# EAGLE design Potentiostat (EAGLE 9.6.2)

## Sheet 1 of 6: Connector & Power Monitor
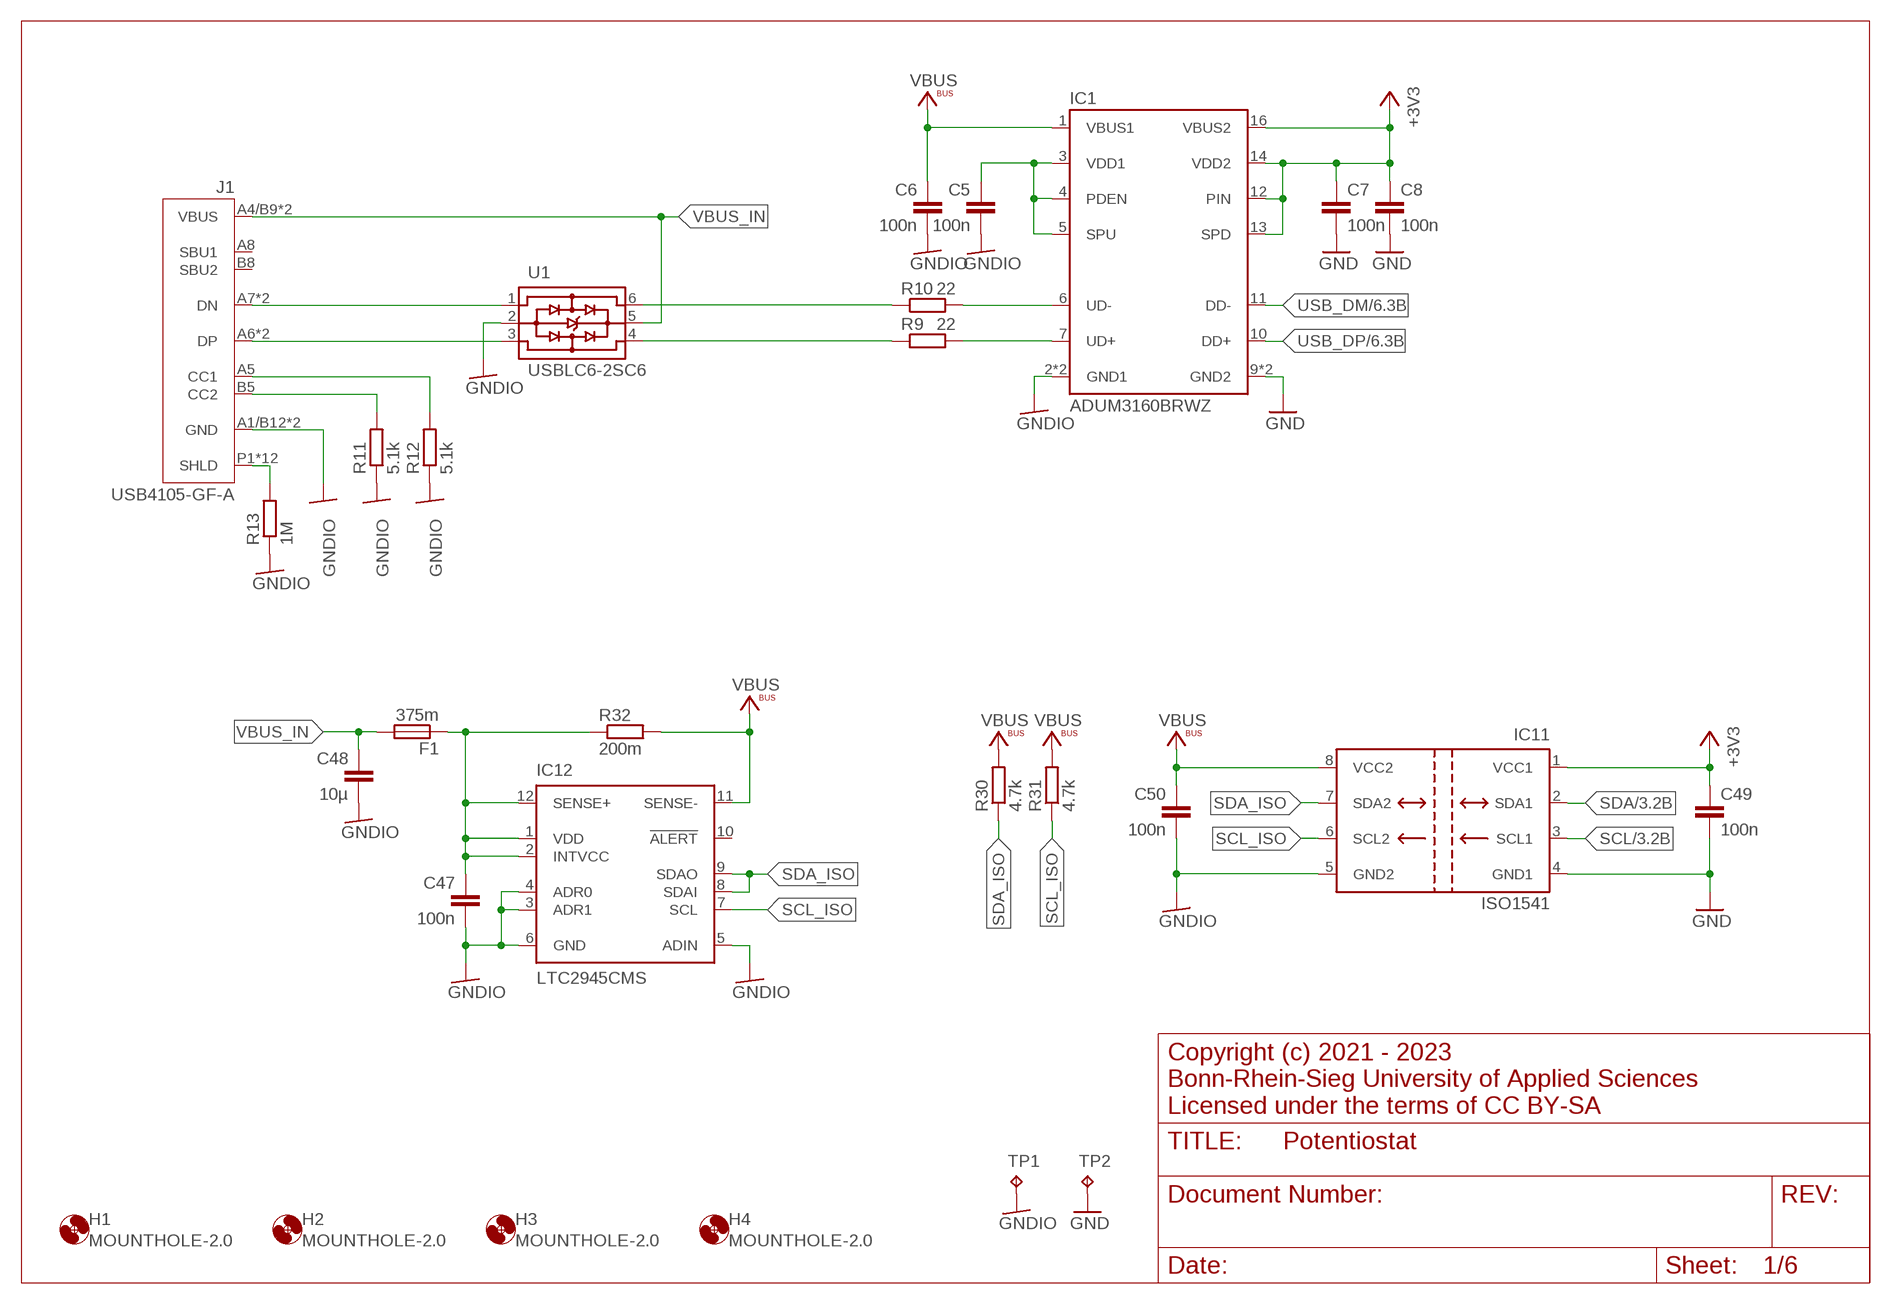
[diagram p0: schematic, sheet 1]

### Parts
C5  100n  C-EUC0603  [C0603]
C6  100n  C-EUC0603  [C0603]
C7  100n  C-EUC0603  [C0603]
C8  100n  C-EUC0603  [C0603]
C47  100n  C-EUC0603  [C0603]
C48  10µ  C-EUC0603  [C0603]
C49  100n  C-EUC0603  [C0603]
C50  100n  C-EUC0603  [C0603]
F1  375m  FUSE0603  [R0603]
H1  MOUNTHOLE-2.0  [2.0]
H2  MOUNTHOLE-2.0  [2.0]
H3  MOUNTHOLE-2.0  [2.0]
H4  MOUNTHOLE-2.0  [2.0]
IC1  ADUM3160BRWZ  [SO16W]
IC11  ISO1541  [SOIC8]
IC12  LTC2945CMS  [MSOP12]
J1  USB4105-GF-A  [USB4105-GF-A]
R9  22  R-EU_R0603  [R0603]
R10  22  R-EU_R0603  [R0603]
R11  5.1k  R-EU_R0603  [R0603]
R12  5.1k  R-EU_R0603  [R0603]
R13  1M  R-EU_R0603  [R0603]
R30  4.7k  R-EU_R0603  [R0603]
R31  4.7k  R-EU_R0603  [R0603]
R32  200m  R-EU_R0805  [R0805]
TP1  TP3.8X2.03  [3.8X2.03]
TP2  TP3.8X2.03  [3.8X2.03]
U1  USBLC6-2SC6  [SOT23-6L]

### Nets
+3V3: C7.1 C8.1 C49.1 IC1.12(PIN) IC1.13(SPD) IC1.14(VDD2) IC1.16(VBUS2) IC11.1(VCC1) ; also sheet 2,3,4,5,6
GND: C7.2 C8.2 C49.2 IC1.9(GND2) IC1.15(GND2) IC11.4(GND1) TP2.TP ; also sheet 2,3,4,5,6
GNDIO: C5.2 C6.2 C47.2 C48.2 C50.2 IC1.2(GND1) IC1.8(GND1) IC11.5(GND2) IC12.3(ADR1) IC12.4(ADR0) IC12.5(ADIN) IC12.6(GND) J1.A1/B12(GND) J1.B1/A12(GND) R11.1 R12.1 R13.1 TP1.TP U1.2 ; also sheet 2
N$6: C5.1 IC1.3(VDD1) IC1.4(PDEN) IC1.5(SPU)
N$7: R10.1 U1.6
N$8: R9.1 U1.4
N$9: IC1.7(UD+) R9.2
N$10: C47.1 F1.1 IC12.1(VDD) IC12.2(INTVCC) IC12.12(SENSE+) R32.1
N$11: J1.A7(DN) J1.B7(DN) U1.1
N$12: J1.A6(DP) J1.B6(DP) U1.3
N$13: J1.A5(CC1) R12.2
N$14: J1.B5(CC2) R11.2
N$16: J1.P1(SHLD) J1.P2(SHLD) J1.P3(SHLD) J1.P4(SHLD) J1.S1(SHLD) J1.S2(SHLD) J1.S3(SHLD) J1.S4(SHLD) J1.S5(SHLD) J1.S6(SHLD) J1.S7(SHLD) J1.S8(SHLD) R13.2
N$46: IC1.6(UD-) R10.2
SCL: IC11.3(SCL1) ; also sheet 3,6
SCL_ISO: IC11.6(SCL2) IC12.7(SCL) R31.1
SDA: IC11.2(SDA1) ; also sheet 3,6
SDA_ISO: IC11.7(SDA2) IC12.8(SDAI) IC12.9(SDAO) R30.1
USB_DM: IC1.11(DD-) ; also sheet 6
USB_DP: IC1.10(DD+) ; also sheet 6
VBUS: C6.1 C50.1 IC1.1(VBUS1) IC11.8(VCC2) IC12.11(SENSE-) R30.2 R31.2 R32.2 ; also sheet 2
VBUS_IN: C48.1 F1.2 J1.A4/B9(VBUS) J1.B4/A9(VBUS) U1.5
Unconnected: IC12.10(!ALERT!) J1.A8(SBU1) J1.B8(SBU2)

### Notes on the sheet
- Copyright (c) 2021 - 2023
  Bonn-Rhein-Sieg University of Applied Sciences
  Licensed under the terms of CC BY-SA

## Sheet 2 of 6: Power Supply
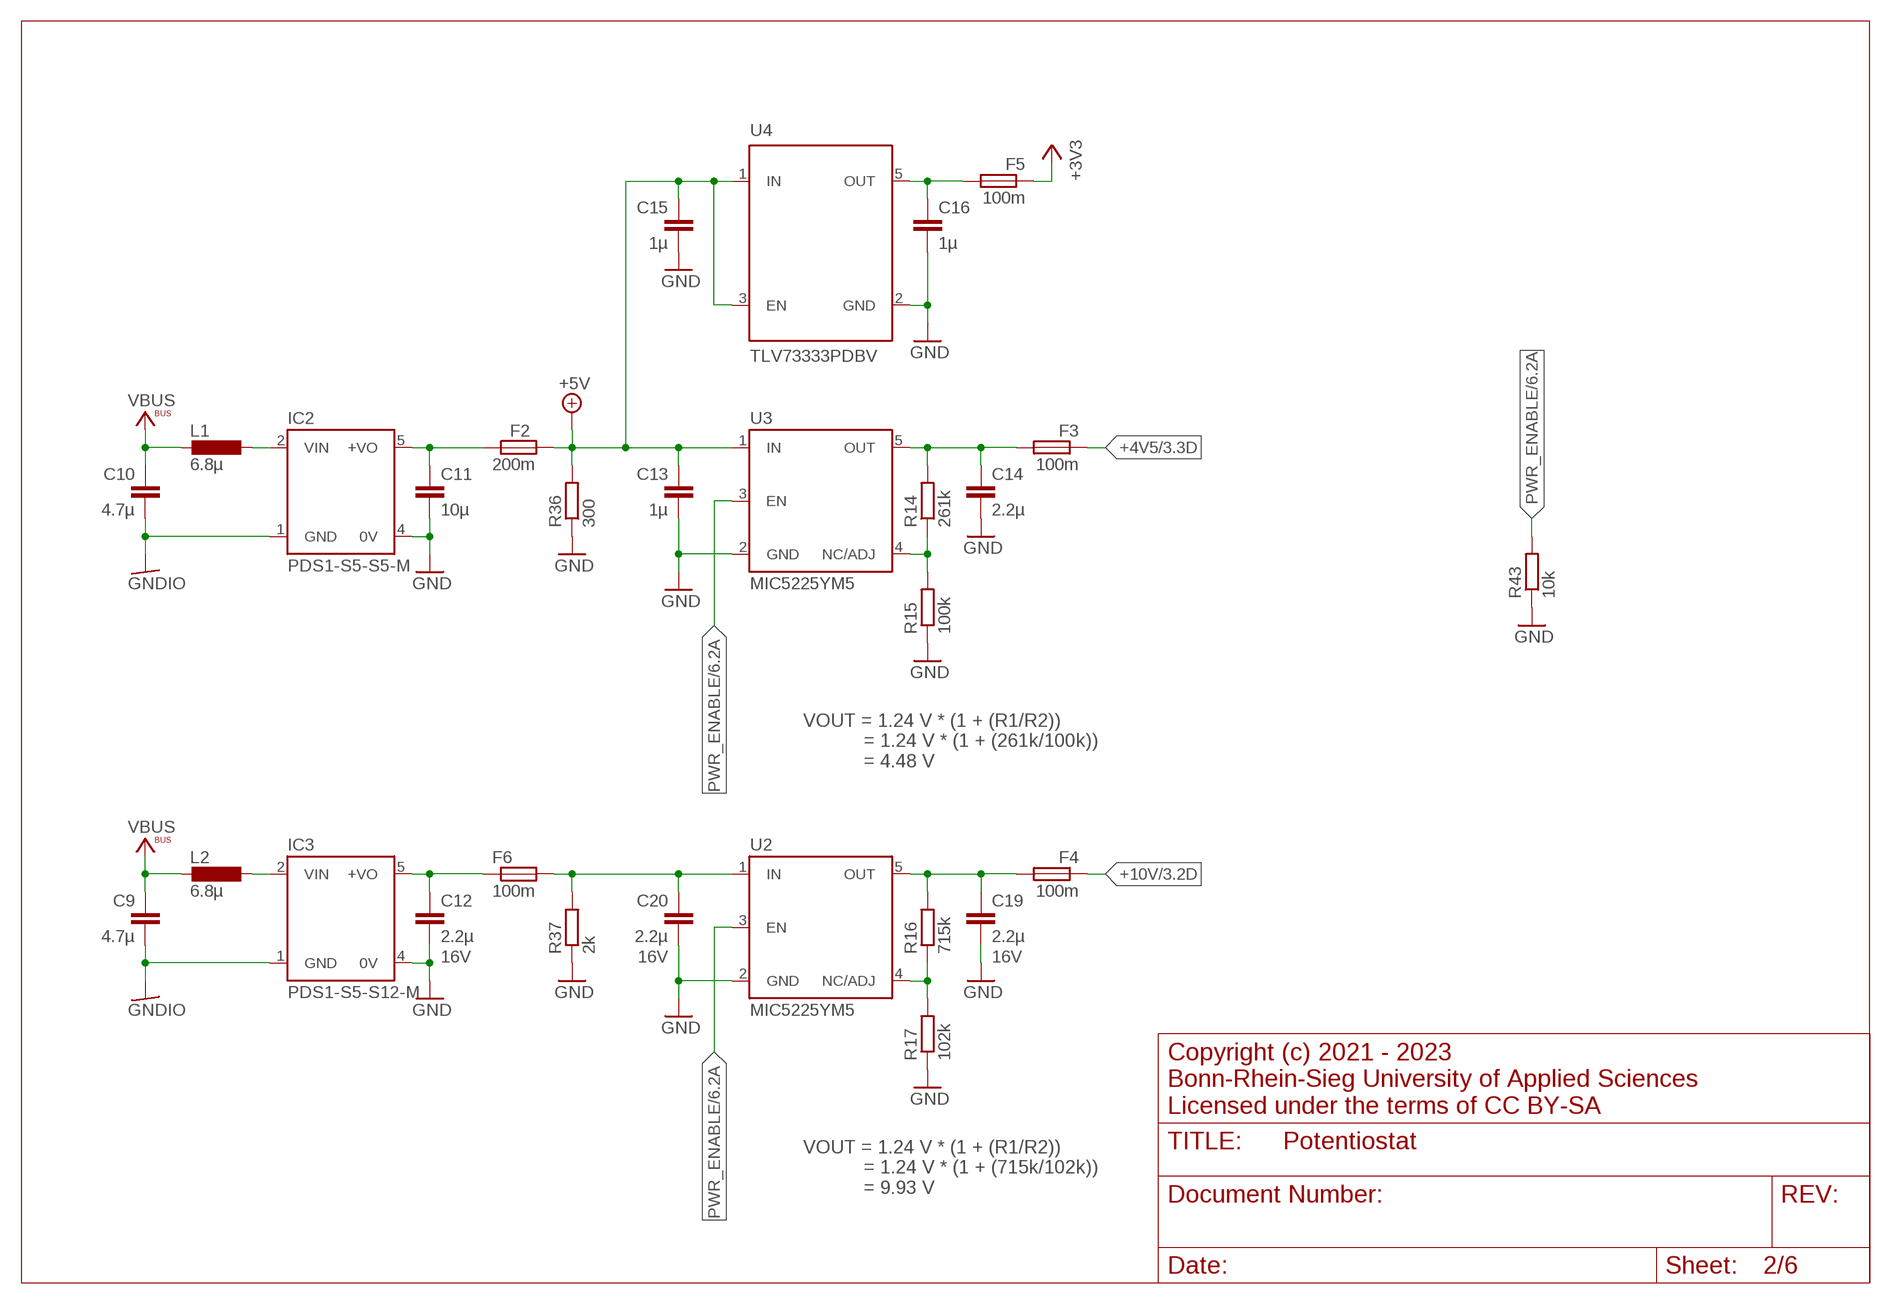
[diagram p1: schematic, sheet 2]

### Parts
C9  4.7µ  C-EUC0603  [C0603]
C10  4.7µ  C-EUC0603  [C0603]
C11  10µ  C-EUC0603  [C0603]
C12  2.2µ  C-EUC0603  [C0603]
C13  1µ  C-EUC0603  [C0603]
C14  2.2µ  C-EUC0603  [C0603]
C15  1µ  C-EUC0603  [C0603]
C16  1µ  C-EUC0603  [C0603]
C19  2.2µ  C-EUC0603  [C0603]
C20  2.2µ  C-EUC0603  [C0603]
F2  200m  FUSE0603  [R0603]
F3  100m  FUSE0603  [R0603]
F4  100m  FUSE0603  [R0603]
F5  100m  FUSE0603  [R0603]
F6  100m  FUSE0603  [R0603]
IC2  PDS1-S5-S5-M  [PDS1-M]
IC3  PDS1-S5-S12-M  [PDS1-M]
L1  6.8µ  L-EUL0603  [L0603]
L2  6.8µ  L-EUL0603  [L0603]
R14  261k  R-EU_R0603  [R0603]
R15  100k  R-EU_R0603  [R0603]
R16  715k  R-EU_R0603  [R0603]
R17  102k  R-EU_R0603  [R0603]
R36  300  R-EU_R0805  [R0805]
R37  2k  R-EU_R0805  [R0805]
R43  10k  R-EU_R0603  [R0603]
U2  MIC5225YM5  [SOT23-5L]
U3  MIC5225YM5  [SOT23-5L]
U4  TLV73333PDBV  [SOT-23]

### Nets
+3V3: F5.1 ; also sheet 1,3,4,5,6
+4V5: F3.1 ; also sheet 3,4,5
+5V: C13.1 C15.1 F2.2 R36.2 U3.1(IN) U4.1(IN) U4.3(EN)
+10V: F4.1 ; also sheet 3,4
GND: C11.2 C12.2 C13.2 C14.2 C15.2 C16.2 C19.2 C20.2 IC2.4(0V) IC3.4(0V) R15.1 R17.1 R36.1 R37.1 R43.1 U2.2(GND) U3.2(GND) U4.2(GND) ; also sheet 1,3,4,5,6
GNDIO: C9.2 C10.2 IC2.1(GND) IC3.1(GND) ; also sheet 1
N$15: R14.1 R15.2 U3.4(NC/ADJ)
N$19: C20.1 F6.2 R37.2 U2.1(IN)
N$20: R16.1 R17.2 U2.4(NC/ADJ)
N$35: C12.1 F6.1 IC3.5(+VO)
N$36: C16.1 F5.2 U4.5(OUT)
N$37: C14.1 F3.2 R14.2 U3.5(OUT)
N$38: C19.1 F4.2 R16.2 U2.5(OUT)
N$39: IC2.2(VIN) L1.1
N$41: IC3.2(VIN) L2.1
N$44: C11.1 F2.1 IC2.5(+VO)
PWR_ENABLE: R43.2 U2.3(EN) U3.3(EN) ; also sheet 6
VBUS: C9.1 C10.1 L1.2 L2.2 ; also sheet 1

### Notes on the sheet
- VOUT = 1.24 V * (1 + (R1/R2))
             = 1.24 V * (1 + (261k/100k))
             = 4.48 V
- Copyright (c) 2021 - 2023
  Bonn-Rhein-Sieg University of Applied Sciences
  Licensed under the terms of CC BY-SA
- VOUT = 1.24 V * (1 + (R1/R2))
             = 1.24 V * (1 + (715k/102k))
             = 9.93 V

## Sheet 3 of 6: Potentiostat Voltage
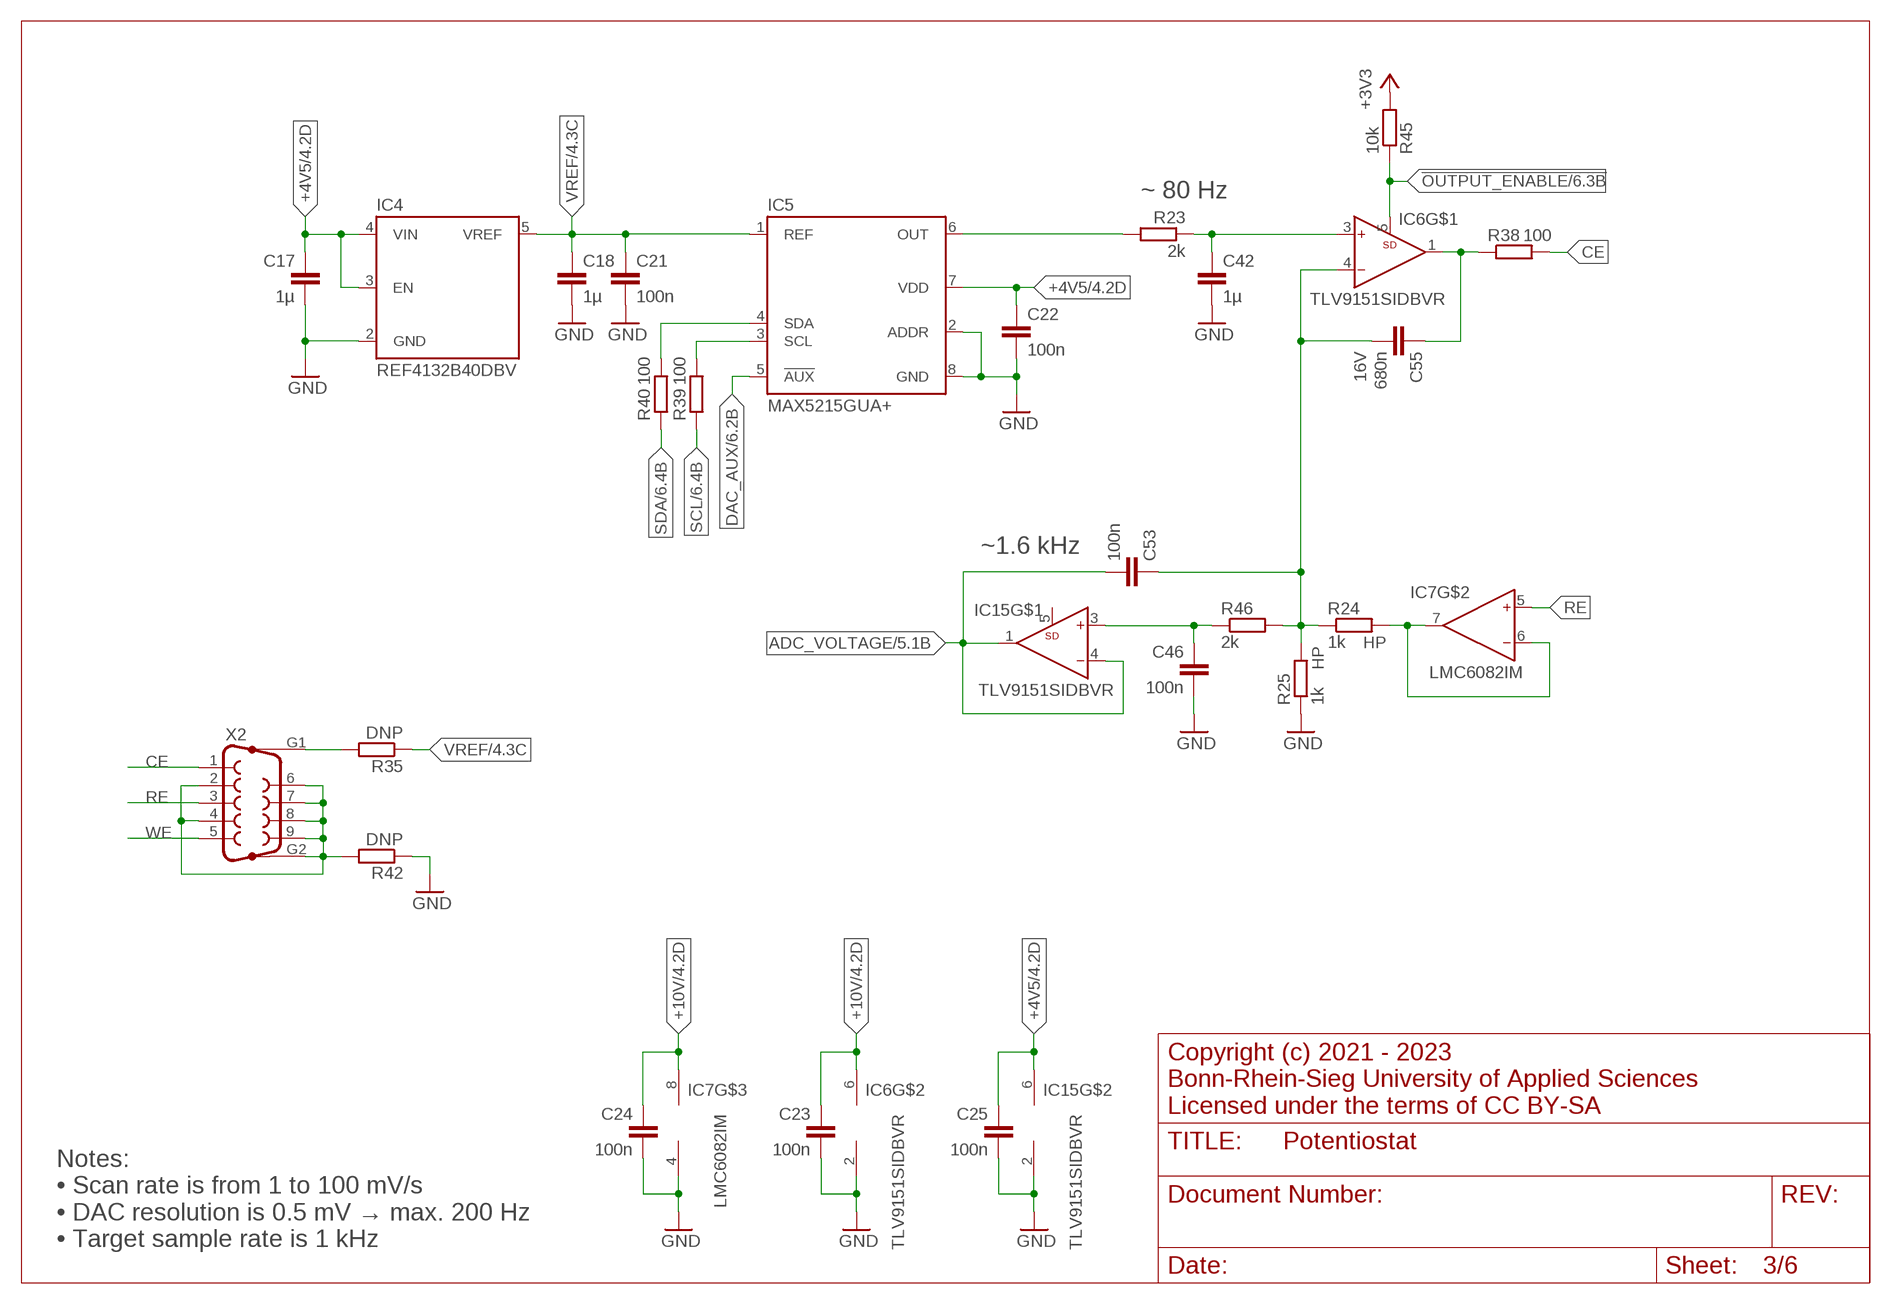
[diagram p2: schematic, sheet 3]

### Parts
C17  1µ  C-EUC0603  [C0603]
C18  1µ  C-EUC0603  [C0603]
C21  100n  C-EUC0603  [C0603]
C22  100n  C-EUC0603  [C0603]
C23  100n  C-EUC0603  [C0603]
C24  100n  C-EUC0603  [C0603]
C25  100n  C-EUC0603  [C0603]
C42  1µ  C-EUC0603  [C0603]
C46  100n  C-EUC0603  [C0603]
C53  100n  C-EUC0603  [C0603]
C55  680n  C-EUC0603  [C0603]
IC4  REF4132B40DBV  [SOT23-5]
IC5  MAX5215GUA+  [MSOP8]
IC6  TLV9151SIDBVR  [SOT23-6]
IC7  LMC6082IM  [SOIC8]
IC15  TLV9151SIDBVR  [SOT23-6]
R23  2k  R-EU_R0603  [R0603]
R24  1k  R-EU_R0603  [R0603]
R25  1k  R-EU_R0603  [R0603]
R35  DNP  R-EU_R0603  [R0603]
R38  100  R-EU_R0603  [R0603]
R39  100  R-EU_R0603  [R0603]
R40  100  R-EU_R0603  [R0603]
R42  DNP  R-EU_R0603  [R0603]
R45  10k  R-EU_R0603  [R0603]
R46  2k  R-EU_R0603  [R0603]
X2  A-DF_09  [A-DF_09]

### Nets
!OUTPUT_ENABLE: IC6.5(SD) R45.1 ; also sheet 6
+3V3: R45.2 ; also sheet 1,2,4,5,6
+4V5: C17.1 C22.1 C25.1 IC4.3(EN) IC4.4(VIN) IC5.7(VDD) IC15.6(V+) ; also sheet 2,4,5
+10V: C23.1 C24.1 IC6.6(V+) IC7.8(V+) ; also sheet 2,4
ADC_VOLTAGE: C53.2 IC15.1(OUT) IC15.4(IN-) ; also sheet 5
CE: R38.2 X2.1
DAC_AUX: IC5.5(!AUX) ; also sheet 6
GND: C17.2 C18.2 C21.2 C22.2 C23.2 C24.2 C25.2 C42.2 C46.2 IC4.2(GND) IC5.2(ADDR) IC5.8(GND) IC6.2(V-) IC7.4(V-) IC15.2(V-) R25.1 R42.1 ; also sheet 1,2,4,5,6
N$1: IC5.6(OUT) R23.2
N$2: IC7.6(IN-) IC7.7(OUT) R24.2
N$3: C53.1 C55.2 IC6.4(IN-) R24.1 R25.2 R46.2
N$27: C42.1 IC6.3(IN+) R23.1
N$33: C55.1 IC6.1(OUT) R38.1
N$34: IC5.3(SCL) R39.2
N$40: R42.2 X2.2 X2.4 X2.6 X2.7 X2.8 X2.9 X2.G2
N$42: R35.2 X2.G1
N$45: IC5.4(SDA) R40.2
N$47: C46.1 IC15.3(IN+) R46.1
RE: IC7.5(IN+) X2.3
SCL: R39.1 ; also sheet 1,6
SDA: R40.1 ; also sheet 1,6
VREF: C18.1 C21.1 IC4.5(VREF) IC5.1(REF) R35.1 ; also sheet 4
WE: X2.5 ; also sheet 4
Unconnected: IC15.5(SD)

### Notes on the sheet
- ~ 80 Hz
- ~1.6 kHz
- Copyright (c) 2021 - 2023
  Bonn-Rhein-Sieg University of Applied Sciences
  Licensed under the terms of CC BY-SA
- Notes:
  • Scan rate is from 1 to 100 mV/s
  • DAC resolution is 0.5 mV → max. 200 Hz
  • Target sample rate is 1 kHz

## Sheet 4 of 6: Potentiostat Current
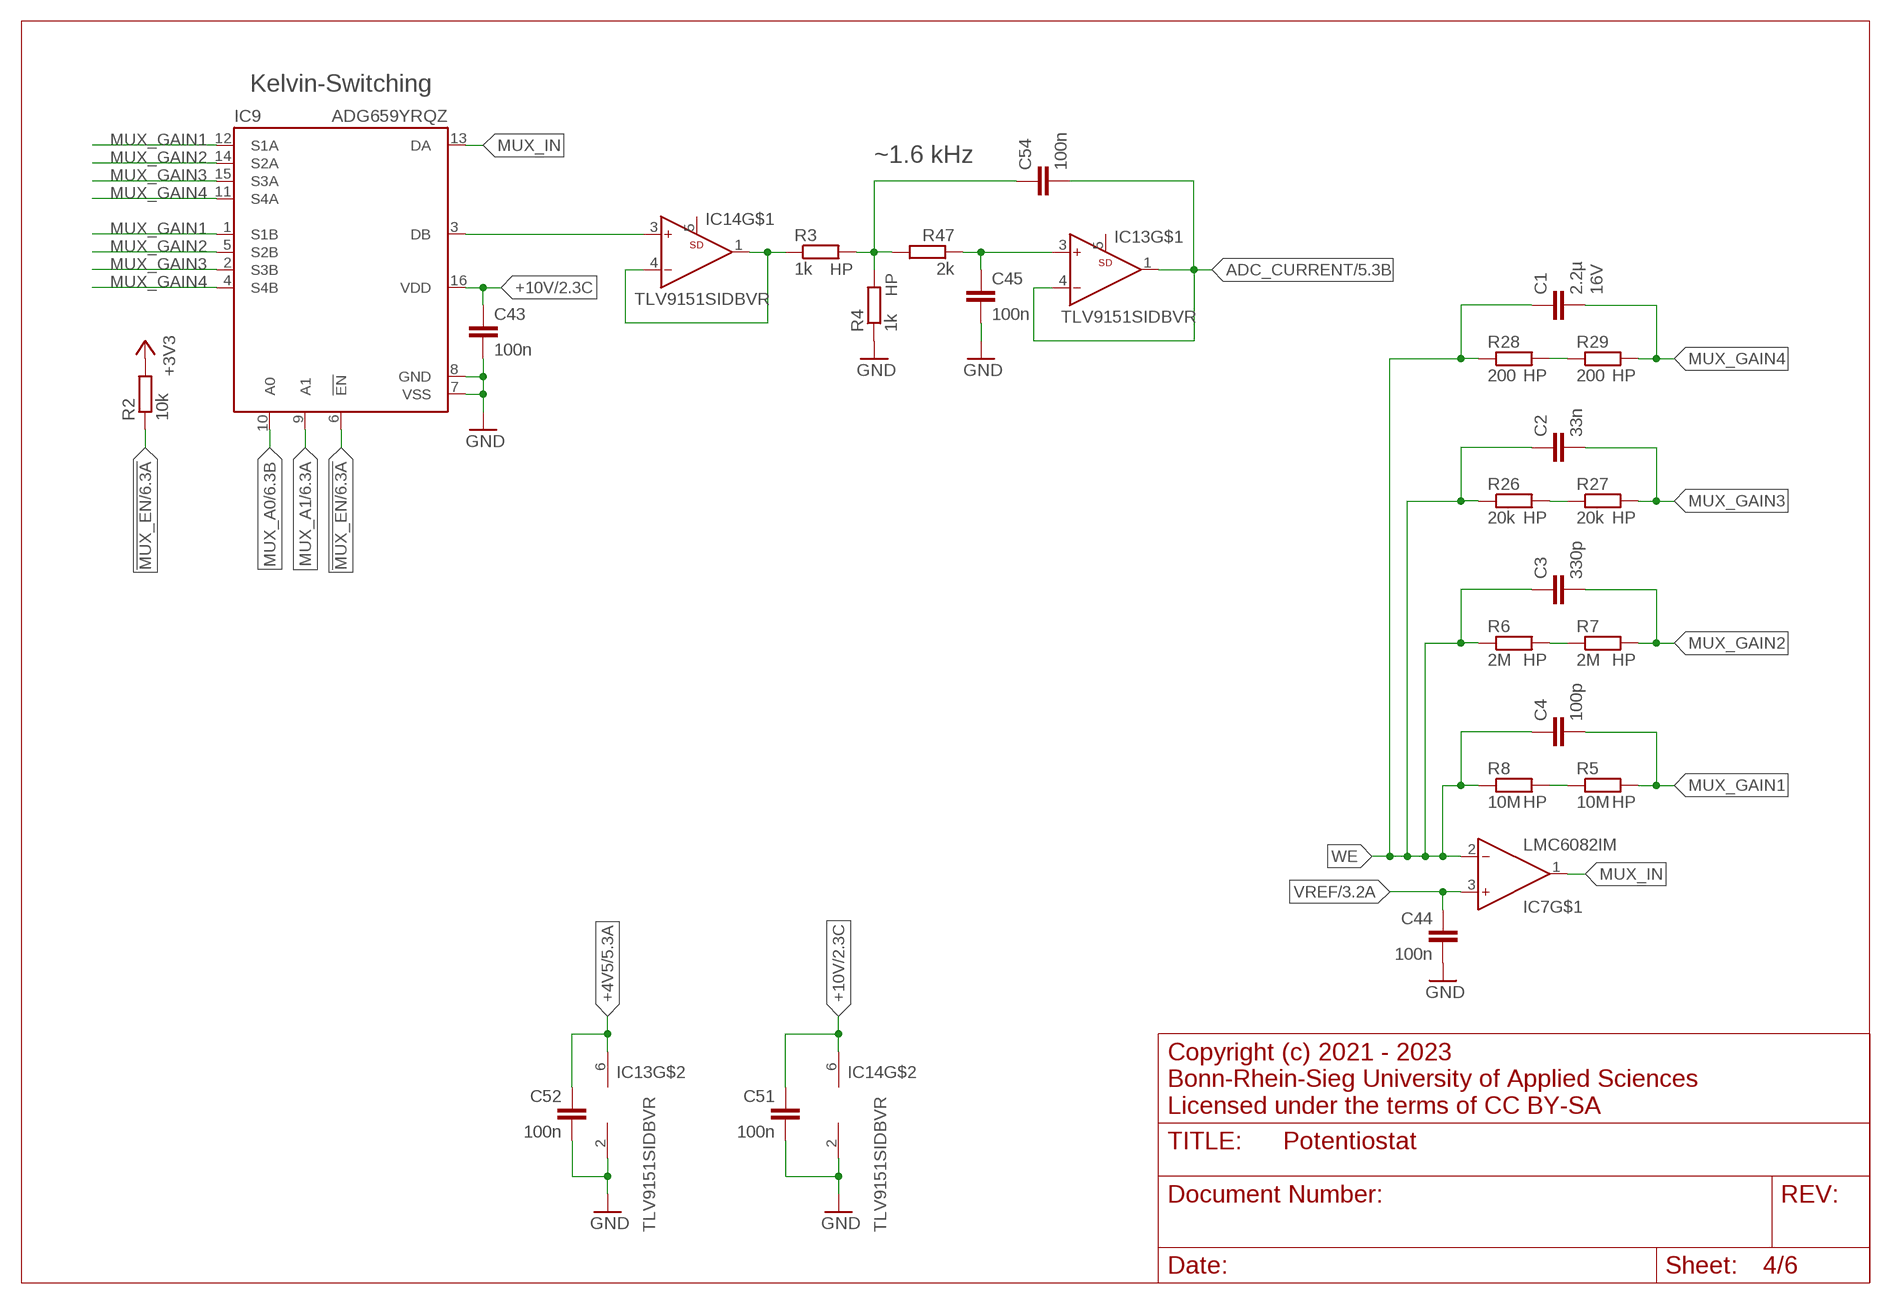
[diagram p3: schematic, sheet 4]

### Parts
C1  2.2µ  C-EUC0603  [C0603]
C2  33n  C-EUC0603  [C0603]
C3  330p  C-EUC0603  [C0603]
C4  100p  C-EUC0603  [C0603]
C43  100n  C-EUC0603  [C0603]
C44  100n  C-EUC0603  [C0603]
C45  100n  C-EUC0603  [C0603]
C51  100n  C-EUC0603  [C0603]
C52  100n  C-EUC0603  [C0603]
C54  100n  C-EUC0603  [C0603]
IC9  ADG659YRQZ  [QSOP16]
IC13  TLV9151SIDBVR  [SOT23-6]
IC14  TLV9151SIDBVR  [SOT23-6]
R2  10k  R-EU_R0603  [R0603]
R3  1k  R-EU_R0603  [R0603]
R4  1k  R-EU_R0603  [R0603]
R5  10M  R-EU_R0805  [R0805]
R6  2M  R-EU_R0805  [R0805]
R7  2M  R-EU_R0805  [R0805]
R8  10M  R-EU_R0805  [R0805]
R26  20k  R-EU_R0805  [R0805]
R27  20k  R-EU_R0805  [R0805]
R28  200  R-EU_R0805  [R0805]
R29  200  R-EU_R0805  [R0805]
R47  2k  R-EU_R0603  [R0603]

### Nets
!MUX_EN: IC9.6(!EN) R2.1 ; also sheet 6
+3V3: R2.2 ; also sheet 1,2,3,5,6
+4V5: C52.1 IC13.6(V+) ; also sheet 2,3,5
+10V: C43.1 C51.1 IC9.16(VDD) IC14.6(V+) ; also sheet 2,3
ADC_CURRENT: C54.2 IC13.1(OUT) IC13.4(IN-) ; also sheet 5
GND: C43.2 C44.2 C45.2 C51.2 C52.2 IC9.7(VSS) IC9.8(GND) IC13.2(V-) IC14.2(V-) R4.1 ; also sheet 1,2,3,5,6
MUX_A0: IC9.10(A0) ; also sheet 6
MUX_A1: IC9.9(A1) ; also sheet 6
MUX_GAIN1: C4.2 IC9.1(S1B) IC9.12(S1A) R5.2
MUX_GAIN2: C3.2 IC9.5(S2B) IC9.14(S2A) R7.2
MUX_GAIN3: C2.2 IC9.2(S3B) IC9.15(S3A) R27.2
MUX_GAIN4: C1.2 IC9.4(S4B) IC9.11(S4A) R29.2
MUX_IN: IC7.1(OUT) IC9.13(DA)
MUX_OUT: IC9.3(DB) IC14.3(IN+)
N$5: C45.1 IC13.3(IN+) R47.1
N$28: R5.1 R8.2
N$29: R6.2 R7.1
N$30: R26.2 R27.1
N$31: R28.2 R29.1
N$32: IC14.1(OUT) IC14.4(IN-) R3.1
N$48: C54.1 R3.2 R4.2 R47.2
VREF: C44.1 IC7.3(IN+) ; also sheet 3
WE: C1.1 C2.1 C3.1 C4.1 IC7.2(IN-) R6.1 R8.1 R26.1 R28.1 ; also sheet 3
Unconnected: IC13.5(SD) IC14.5(SD)

### Notes on the sheet
- Kelvin-Switching
- ~1.6 kHz
- Copyright (c) 2021 - 2023
  Bonn-Rhein-Sieg University of Applied Sciences
  Licensed under the terms of CC BY-SA

## Sheet 5 of 6: A/D Conversion
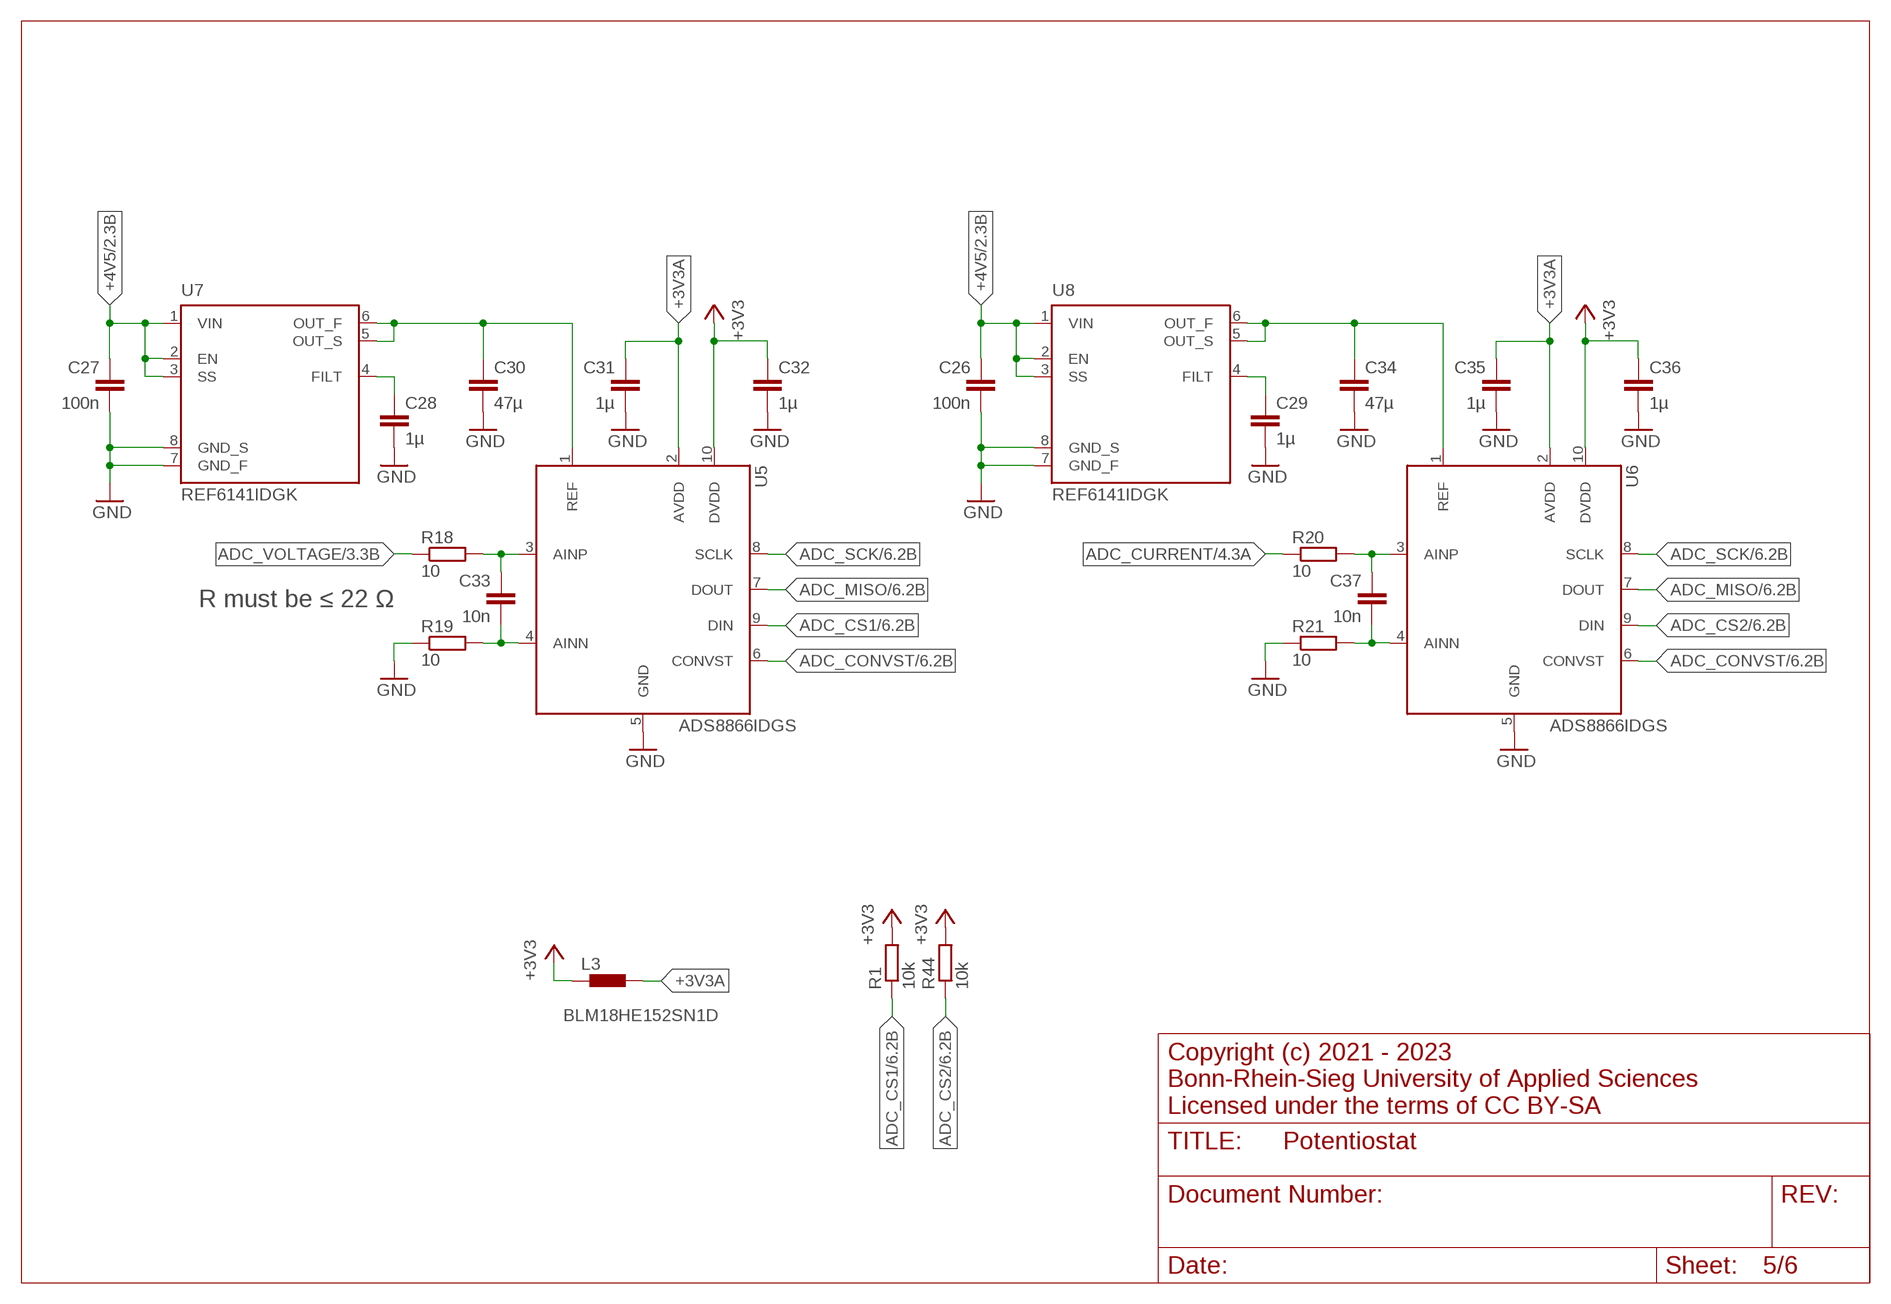
[diagram p4: schematic, sheet 5]

### Parts
C26  100n  C-EUC0603  [C0603]
C27  100n  C-EUC0603  [C0603]
C28  1µ  C-EUC0603  [C0603]
C29  1µ  C-EUC0603  [C0603]
C30  47µ  C-EUC0805  [C0805]
C31  1µ  C-EUC0603  [C0603]
C32  1µ  C-EUC0603  [C0603]
C33  10n  C-EUC0603  [C0603]
C34  47µ  C-EUC0805  [C0805]
C35  1µ  C-EUC0603  [C0603]
C36  1µ  C-EUC0603  [C0603]
C37  10n  C-EUC0603  [C0603]
L3  BLM18HE152SN1D  [0603]
R1  10k  R-EU_R0603  [R0603]
R18  10  R-EU_R0603  [R0603]
R19  10  R-EU_R0603  [R0603]
R20  10  R-EU_R0603  [R0603]
R21  10  R-EU_R0603  [R0603]
R44  10k  R-EU_R0603  [R0603]
U5  ADS8866IDGS  [MSOP10]
U6  ADS8866IDGS  [MSOP10]
U7  REF6141IDGK  [VSSOP8]
U8  REF6141IDGK  [VSSOP8]

### Nets
+3V3: C32.1 C36.1 L3.2 R1.2 R44.2 U5.10(DVDD) U6.10(DVDD) ; also sheet 1,2,3,4,6
+3V3A: C31.1 C35.1 L3.1 U5.2(AVDD) U6.2(AVDD)
+4V5: C26.1 C27.1 U7.1(VIN) U7.2(EN) U7.3(SS) U8.1(VIN) U8.2(EN) U8.3(SS) ; also sheet 2,3,4
ADC_CONVST: U5.6(CONVST) U6.6(CONVST) ; also sheet 6
ADC_CS1: R1.1 U5.9(DIN) ; also sheet 6
ADC_CS2: R44.1 U6.9(DIN) ; also sheet 6
ADC_CURRENT: R20.1 ; also sheet 4
ADC_MISO: U5.7(DOUT) U6.7(DOUT) ; also sheet 6
ADC_SCK: U5.8(SCLK) U6.8(SCLK) ; also sheet 6
ADC_VOLTAGE: R18.1 ; also sheet 3
GND: C26.2 C27.2 C28.2 C29.2 C30.2 C31.2 C32.2 C34.2 C35.2 C36.2 R19.1 R21.1 U5.5(GND) U6.5(GND) U7.7(GND_F) U7.8(GND_S) U8.7(GND_F) U8.8(GND_S) ; also sheet 1,2,3,4,6
N$4: C28.1 U7.4(FILT)
N$17: C30.1 U5.1(REF) U7.5(OUT_S) U7.6(OUT_F)
N$18: C33.1 R18.2 U5.3(AINP)
N$21: C29.1 U8.4(FILT)
N$22: C34.1 U6.1(REF) U8.5(OUT_S) U8.6(OUT_F)
N$23: C33.2 R19.2 U5.4(AINN)
N$24: C37.1 R20.2 U6.3(AINP)
N$25: C37.2 R21.2 U6.4(AINN)

### Notes on the sheet
- R must be ≤ 22 Ω
- Copyright (c) 2021 - 2023
  Bonn-Rhein-Sieg University of Applied Sciences
  Licensed under the terms of CC BY-SA

## Sheet 6 of 6: µController
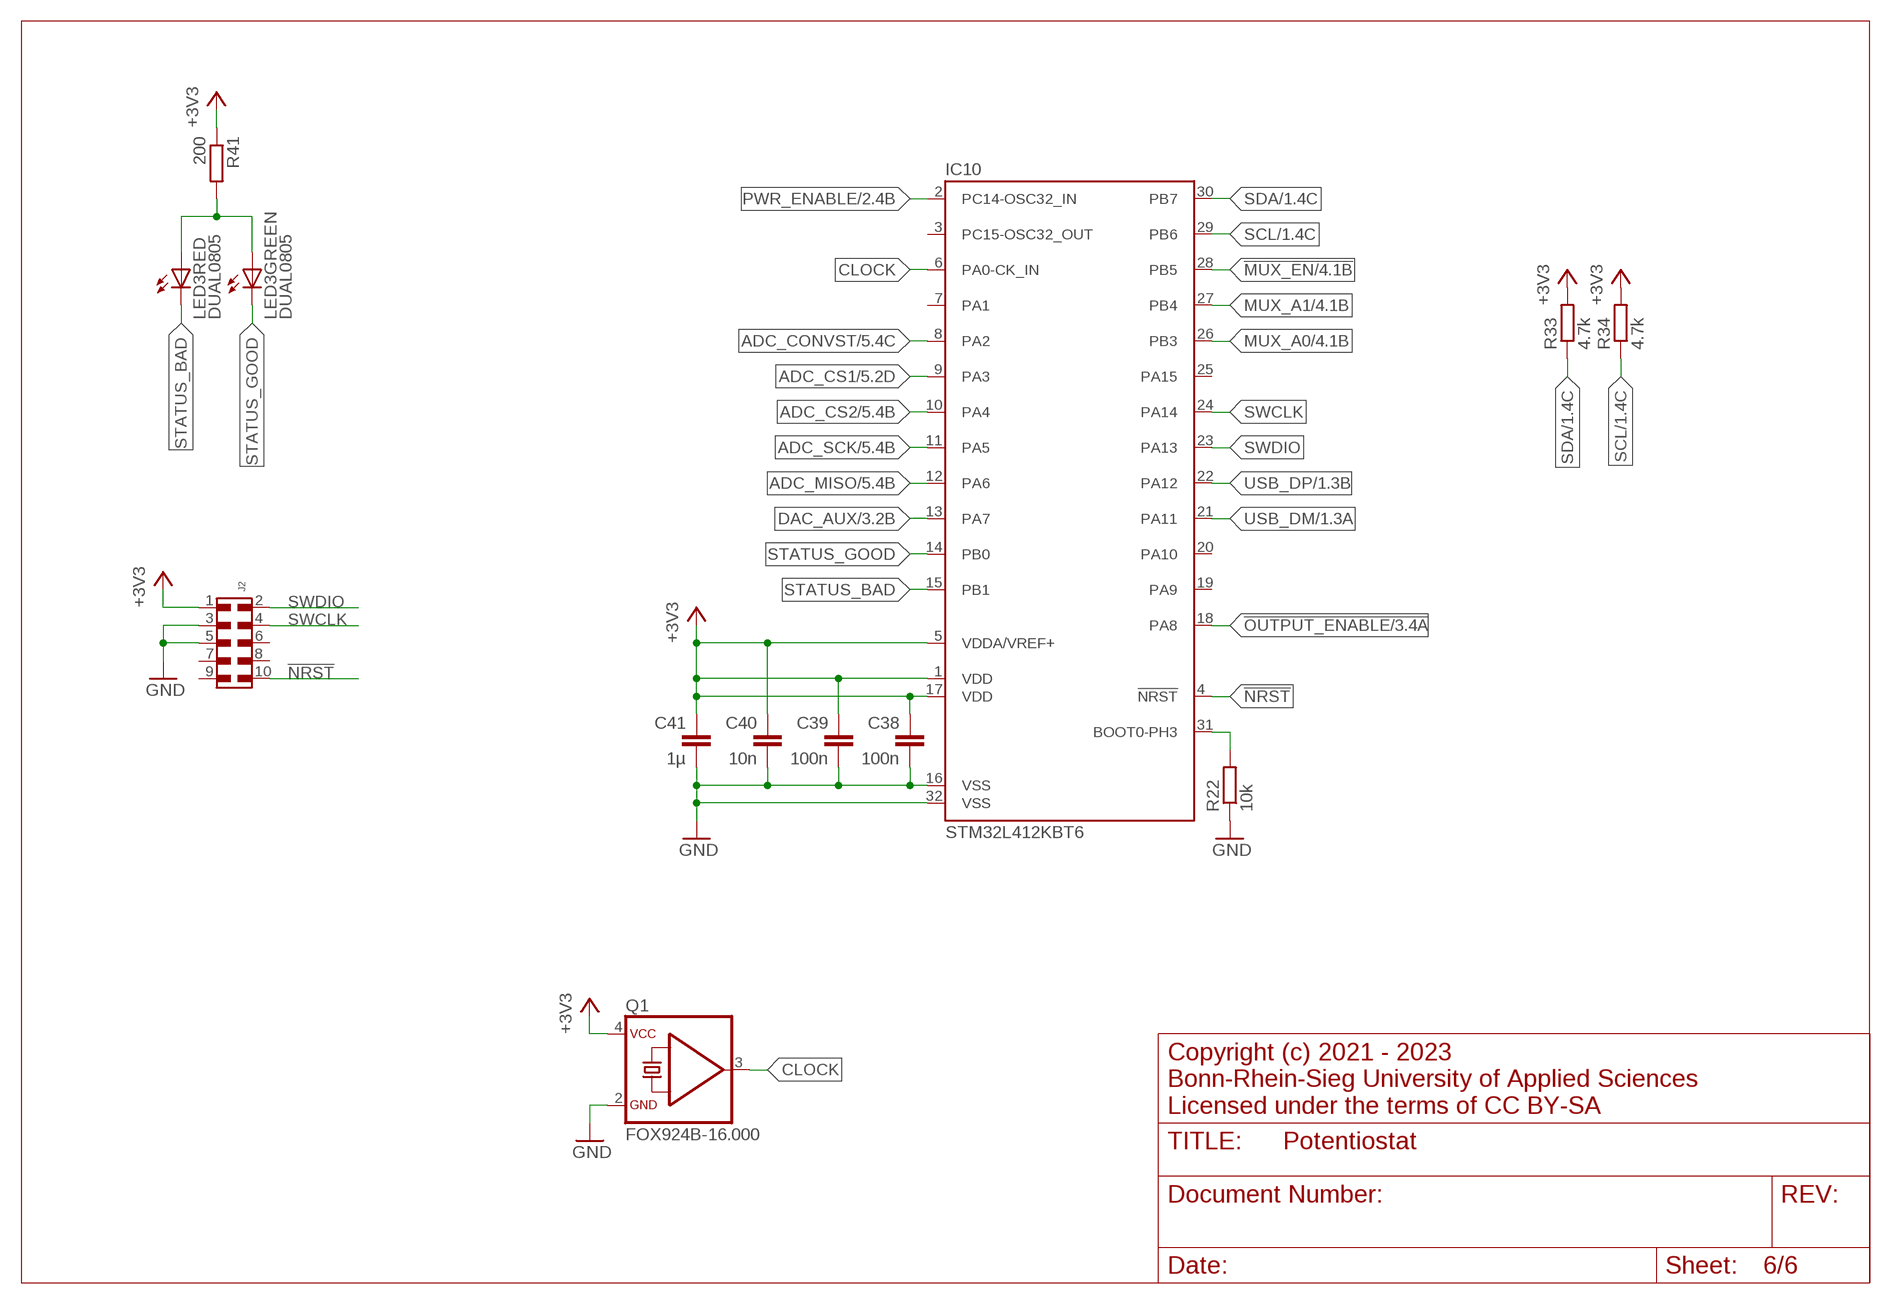
[diagram p5: schematic, sheet 6]

### Parts
C38  100n  C-EUC0603  [C0603]
C39  100n  C-EUC0603  [C0603]
C40  10n  C-EUC0603  [C0603]
C41  1µ  C-EUC0603  [C0603]
IC10  STM32L412KBT6  [LQFP32]
J2  6210XX21021_62101021021  [62101021021]
LED3  DUAL0805  [CHIPLEDX2]
Q1  FOX924B-16.000  [FOX924B]
R22  10k  R-EU_R0603  [R0603]
R33  4.7k  R-EU_R0603  [R0603]
R34  4.7k  R-EU_R0603  [R0603]
R41  200  R-EU_R0603  [R0603]

### Nets
!MUX_EN: IC10.28(PB5) ; also sheet 4
!NRST: IC10.4(!NRST) J2.10
!OUTPUT_ENABLE: IC10.18(PA8) ; also sheet 3
+3V3: C38.1 C39.1 C40.1 C41.1 IC10.1(VDD) IC10.5(VDDA/VREF+) IC10.17(VDD) J2.1 Q1.4(VCC) R33.2 R34.2 R41.1 ; also sheet 1,2,3,4,5
ADC_CONVST: IC10.8(PA2) ; also sheet 5
ADC_CS1: IC10.9(PA3) ; also sheet 5
ADC_CS2: IC10.10(PA4) ; also sheet 5
ADC_MISO: IC10.12(PA6) ; also sheet 5
ADC_SCK: IC10.11(PA5) ; also sheet 5
CLOCK: IC10.6(PA0-CK_IN) Q1.3(OUT)
DAC_AUX: IC10.13(PA7) ; also sheet 3
GND: C38.2 C39.2 C40.2 C41.2 IC10.16(VSS) IC10.32(VSS) J2.3 J2.5 Q1.2(GND) R22.1 ; also sheet 1,2,3,4,5
MUX_A0: IC10.26(PB3) ; also sheet 4
MUX_A1: IC10.27(PB4) ; also sheet 4
N$26: IC10.31(BOOT0-PH3) R22.2
N$43: LED3.A1(RED:A) LED3.A2(GREEN:A) R41.2
PWR_ENABLE: IC10.2(PC14-OSC32_IN) ; also sheet 2
SCL: IC10.29(PB6) R34.1 ; also sheet 1,3
SDA: IC10.30(PB7) R33.1 ; also sheet 1,3
STATUS_BAD: IC10.15(PB1) LED3.C1(RED:C)
STATUS_GOOD: IC10.14(PB0) LED3.C2(GREEN:C)
SWCLK: IC10.24(PA14) J2.4
SWDIO: IC10.23(PA13) J2.2
USB_DM: IC10.21(PA11) ; also sheet 1
USB_DP: IC10.22(PA12) ; also sheet 1
Unconnected: IC10.3(PC15-OSC32_OUT) IC10.7(PA1) IC10.19(PA9) IC10.20(PA10) IC10.25(PA15) J2.6 J2.7 J2.8 J2.9

### Notes on the sheet
- Copyright (c) 2021 - 2023
  Bonn-Rhein-Sieg University of Applied Sciences
  Licensed under the terms of CC BY-SA

## Library data of the parts
C1 C12 C19 C20 C55 = rcl:C-EU: CAPACITOR, European symbol; RATING: 16V
C2-C11 C13-C18 C21-C54 = rcl:C-EU: CAPACITOR, European symbol
F1-F6 = Fuse0603:FUSE: Surface mount fuse
H1-H4 = MountHoles:MOUNTHOLE-2.0
IC1 = ADUM3160:ADUM3160: Full/Low Speed 2.5 kV USB Digital Isolator
IC2 IC3 = PDS1-M:PDS1-S?-S*-M: DC-DC CONVERTER, 1 W isolated, unregulated output, 1.5 kVdc isolation
IC4 = REF4132:REF4132: Low-Drift, Low-Power, Small-Footprint Series Voltage Reference
IC5 = MAX521x:MAX521*GUA+: 14-/16-Bit, Low-Power, Buffered Output, Rail-to-Rail DACs with I2C Interface
IC6 IC13-IC15 = TLV915x:TLV9151SI?R: 4.5-MHz, Rail-to-Rail Input/Output, Low Offset Voltage, Low Noise Op Amp
IC7 = LMC6082:LMC6082: Precision CMOS Dual Operational Amplifier
IC9 = ADG65x:ADG659: +3 V/+5 V/±5 V CMOS 4- and 8-Channel Analog Multiplexers
IC10 = STM32:STM32L412K*?: Ultra-low-power ARM Cortex-M4 32-bit MCU+FPU, 100DMIPS, up to 128KB Flash, 40KB SRAM, analog, ext. SMPS
IC11 = ISO154X:ISO1541: Low-Power Bidirectional I2C Isolators
IC12 = LTC2945:LTC2945: Wide Range I2C Power Monitor
J1 = USB-C:USB4105-GF-A: USB Type C Receptacle for USB 2.0, SMT Type, PCB Top Mount
J2 = WR-PHD:6210XX21021_62101021021: WR-PHD 1.27 mm SMT Dual Pin Header, H=3.80 mm ARTICLE PROPERTIES: Pins:4;​ 8;​ 10;​ 14;​ 16;​ 20;​ 28;​ 40;​ 44;​ 50 KIND PROPERTIES: Pitch：1.27 mm Quality Class:3 as per CECC 75 301-802 Rows：Dual Gender：Pin Header Type：Straight MATERIAL PROPERTIES: Insulator Material :PA9T Insulator Flammability Rating:UL94 V-0 Contact Material:Copper Alloy Contact Plating:Gold Contact Type:Stamped GENERAL INFORMATION Operating Temperature:-40 up to +105 °C Compliance:Lead free / RoHS ELECTRICAL PROPERTIES: Rated Current:1 A;​ max. IR1:1 A Withstanding Voltage:500 V (AC) Contact Resistance:20 mΩ RISO:1000 MΩ CERTIFICATION UL Approval:E323964 PACKAGING PROPERTIES Packaging:Tube Packaging Unit:228;​ 114;​ 91;​ 65;​ 57;​ 45;​ 32;​ 23;​ 20;​ 18 <https://katalog.we-online.com/media/images/v2/o33195v209%20Family_WR-PDH_621xxx21021.jpg> Details see: https://katalog.we-online.com/en/em/PHD_1_27_SMT_DUAL_PIN_HEADER_6210XX21021 Updated by Yingchun,Shan 2019-10-25 2019 (C) Würth Elektronik; DATASHEET-URL: https://katalog.we-online.com/em/datasheet/62101021021.pdf; GENDER: Pin Header; IR: 1A; MATES: WR-PHD 1.27mm Dual Socket Header/SMT Dual Socket Header,H=4.5mm/SMT Dual Socket Header,H=4.5mm(Reel); PACKAGING: Tube; PART-NUMBER: 62101021021; PINS: 10; ROWS: Dual; TYPE: Straight
L1 L2 = rcl:L-EU: INDUCTOR, European symbol; FBS_ID: 1249
L3 = BLM18H:BLM18H: Chip Ferrite Bead for GHz Noise
LED3 = DualLED:DUAL0805: Kingbright APHBM2012SURKCGKC (www.digikey.de/product-detail/de/kingbright/APHBM2012SURKCGKC/754-1093-1-ND/1747810)
Q1 = FOX924B:FOX924B
R1 R2 R9-R21 R23 R30-R40 R42-R47 = rcl:R-EU_: RESISTOR, European symbol
R3-R8 R24-R29 = rcl:R-EU_: RESISTOR, European symbol; HP: 1
R22 R41 = rcl:R-EU_: RESISTOR, European symbol; SPICEPREFIX: R
TP1 TP2 = Testpoints:TP: KEYSTONE SURFACE MOUNT TEST POINTS
U1 = USBLC6-2:USBLC6-2: Very low capacitance ESD protection
U2 U3 = MIC5225:MIC5225: Ultra-Low Quiescent Current 150mA μCap Low Dropout Regulator
U4 = TLV733P:TLV733*P?: TLV733P Capacitor-Free, 300-mA, Low-Dropout Regulator in 1-mm × 1-mm X2SON Package
U5 U6 = ADS8866:ADS8866: 16-bit, 100-kSPS, serial interface, micropower, miniature, single-ended input, SAR analog-to-digital converter
U7 U8 = REF61xx:REF61: High-Precision Voltage Reference With Integrated ADC Drive Buffer
X2 = D-SUB:A-DF_09: SUB-D

## Board
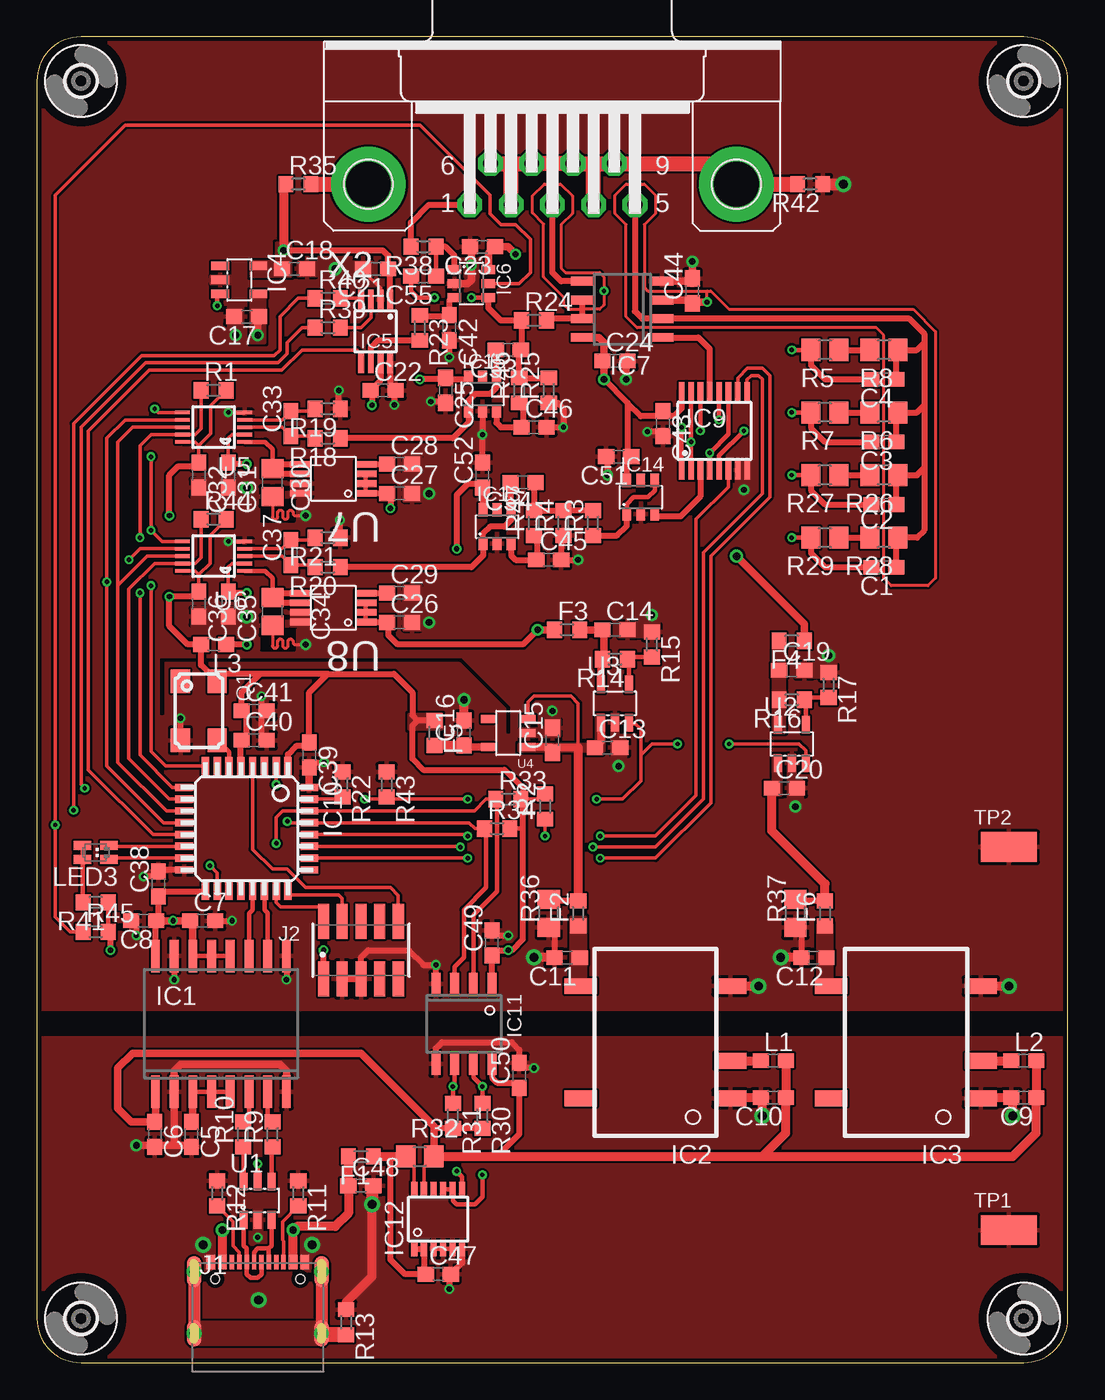
[diagram p6: board, top side]
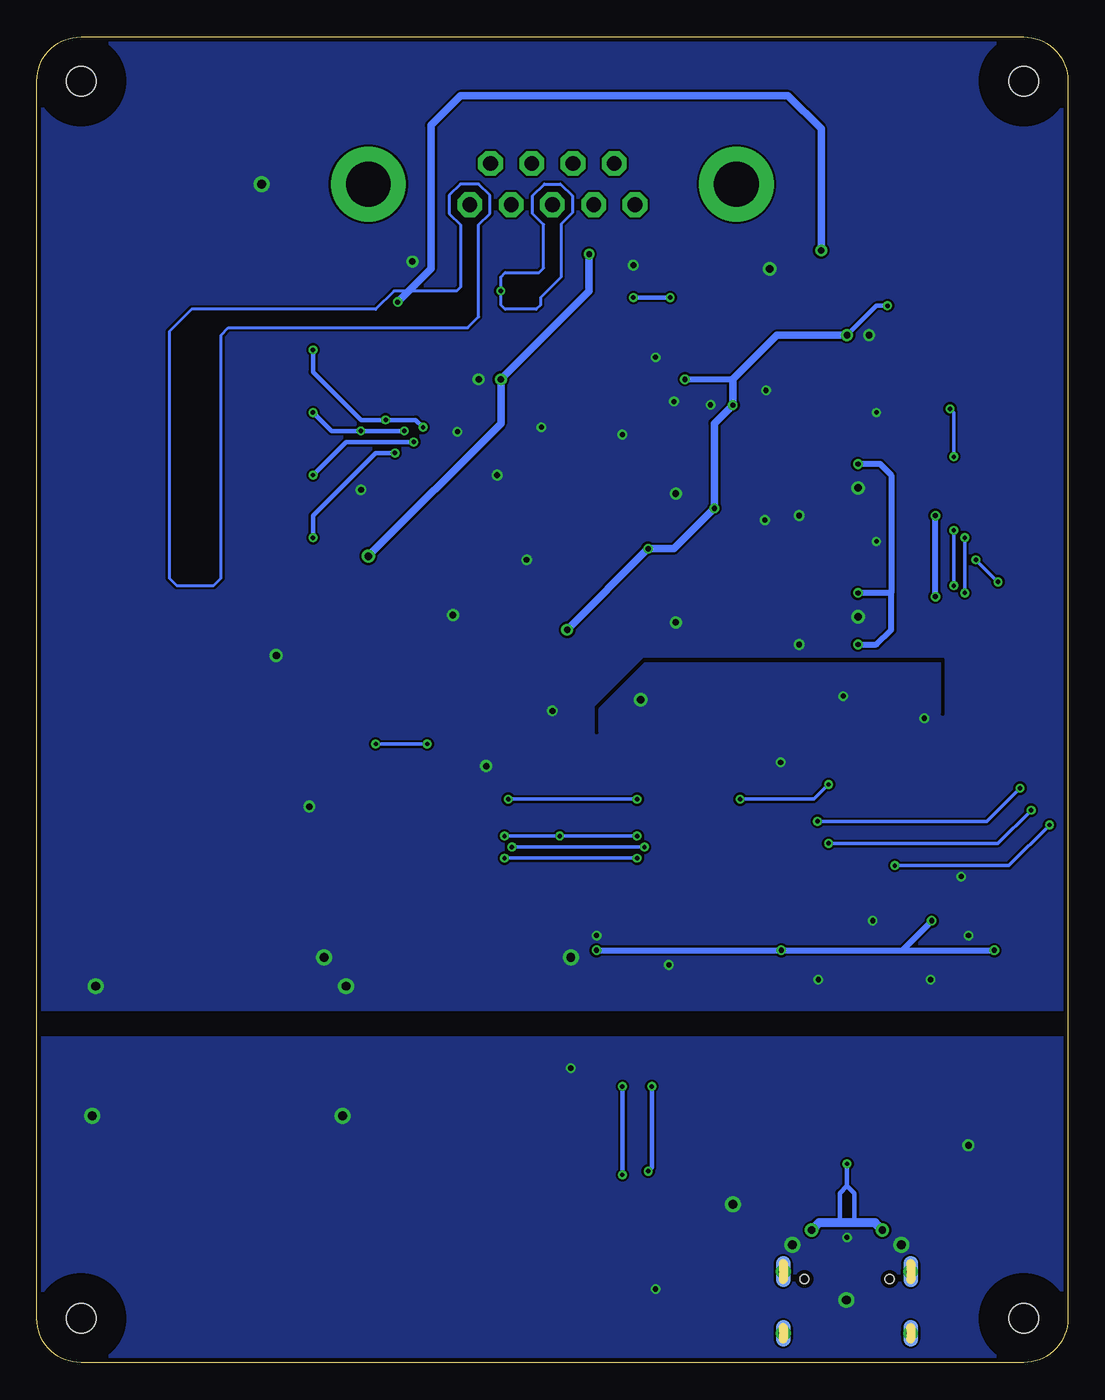
[diagram p7: board, bottom side, seen from below]

Size 70 x 90 mm. Coordinates in mm from the lower left corner, seen from the top.
Outline: 0,3 arc90 3,0 67,0 arc90 70,3 70,87 arc90 67,90 3,90 arc90 0,87 0,3
Copper layers (1*16): Top 0.035mm / dielectric 1.5mm / Bottom 0.035mm
Design rules "PCB-POOL Standard": minimum track width 0.15mm, minimum drill 0.3mm, track to track 0.15mm, track to pad 0.15mm, pad to pad 0.15mm, via to via 0.15mm, smd to smd 0.15mm, copper to edge 0.3mm, drill to drill 0.2mm, minimum pad ring 0.2mm, minimum via ring 0.15mm, stop-mask expansion 0.075mm, vias tented up to drill 0mil, thermal gap 0.2mm

### Footprints (pad centres in the part's own frame; a part is rotated, then mirrored left to right if it is on the bottom)
C0603 = smd 1.1 x 1: 1 -0.85,0; 2 0.85,0
C0805 = smd 1.3 x 1.5: 1 -0.95,0; 2 0.95,0
R0603 = smd 1 x 1.1: 1 -0.85,0; 2 0.85,0
2.0 = hole 2: 0,0
SO16W = smd 0.6 x 2.2: 1 -4.445,-4.6; 2 -3.175,-4.6; 3 -1.905,-4.6; 4 -0.635,-4.6; 5 0.635,-4.6; 6 1.905,-4.6; 7 3.175,-4.6; 8 4.445,-4.6; 9 4.445,4.6; 10 3.175,4.6; 11 1.905,4.6; 12 0.635,4.6; 13 -0.635,4.6; 14 -1.905,4.6; 15 -3.175,4.6; 16 -4.445,4.6
PDS1-M = smd 1.067 x 2.184: 1 -3.81,-5.08; 2 -1.27,-5.08; 4 3.81,-5.08; 5 3.81,5.08; 8 -3.81,5.08
SOT23-5 = smd 0.55 x 1.2: 1 -0.95,-1.3; 2 0,-1.3; 3 0.95,-1.3; 4 0.95,1.3; 5 -0.95,1.3
MSOP8 = smd 0.4 x 1.35: 1 -0.975,-2.15; 2 -0.325,-2.15; 3 0.325,-2.15; 4 0.975,-2.15; 5 0.975,2.15; 6 0.325,2.15; 7 -0.325,2.15; 8 -0.975,2.15
SOT23-6 = smd 0.6 x 0.9: 1 -0.95,-1.15; 2 0,-1.15; 3 0.95,-1.15; 4 0.95,1.15; 5 0,1.15; 6 -0.95,1.15
SOIC8 = smd 0.6 x 1.55: 1 -1.905,-2.7; 2 -0.635,-2.7; 3 0.635,-2.7; 4 1.905,-2.7; 5 1.905,2.7; 6 0.635,2.7; 7 -0.635,2.7; 8 -1.905,2.7
QSOP16 = smd 0.381 x 1.27: 1 -2.223,-2.667; 2 -1.587,-2.667; 3 -0.953,-2.667; 4 -0.318,-2.667; 5 0.318,-2.667; 6 0.953,-2.667; 7 1.587,-2.667; 8 2.223,-2.667; 9 2.223,2.667; 10 1.587,2.667; 11 0.953,2.667; 12 0.318,2.667; 13 -0.318,2.667; 14 -0.953,2.667; 15 -1.587,2.667; 16 -2.223,2.667
LQFP32 = smd 0.5 x 1.2: 1 -2.8,-4.25; 2 -2,-4.25; 3 -1.2,-4.25; 4 -0.4,-4.25; 5 0.4,-4.25; 6 1.2,-4.25; 7 2,-4.25; 8 2.8,-4.25; 17 2.8,4.25; 18 2,4.25; 19 1.2,4.25; 20 0.4,4.25; 21 -0.4,4.25; 22 -1.2,4.25; 23 -2,4.25; 24 -2.8,4.25 | smd 1.2 x 0.5: 9 4.25,-2.8; 10 4.25,-2; 11 4.25,-1.2; 12 4.25,-0.4; 13 4.25,0.4; 14 4.25,1.2; 15 4.25,2; 16 4.25,2.8; 25 -4.25,2.8; 26 -4.25,2; 27 -4.25,1.2; 28 -4.25,0.4; 29 -4.25,-0.4; 30 -4.25,-1.2; 31 -4.25,-2; 32 -4.25,-2.8
SOIC8' = smd 1.55 x 0.6: 1 -2.7,1.905; 2 -2.7,0.635; 3 -2.7,-0.635; 4 -2.7,-1.905; 5 2.7,-1.905; 6 2.7,-0.635; 7 2.7,0.635; 8 2.7,1.905
MSOP12 = smd 0.419 x 1.016: 1 -1.626,-2.032; 2 -0.975,-2.032; 3 -0.325,-2.032; 4 0.325,-2.032; 5 0.975,-2.032; 6 1.626,-2.032; 7 1.626,2.032; 8 0.975,2.032; 9 0.325,2.032; 10 -0.325,2.032; 11 -0.975,2.032; 12 -1.626,2.032
USB4105-GF-A = smd 0.6 x 1: A1/B12 -3.2,4.83; A4/B9 -2.4,4.83; B1/A12 3.2,4.83; B4/A9 2.4,4.83 | smd 0.3 x 1: A5 -1.25,4.83; A6 -0.25,4.83; A7 0.25,4.83; A8 1.25,4.83; B5 1.75,4.83; B6 0.75,4.83; B7 -0.75,4.83; B8 -1.75,4.83 | drill 0.6 pad 1: P1 -4.32,4.18; P2 4.32,4.18; P3 -4.32,0; P4 4.32,0 | smd 1 x 2.1: S1 -4.32,4.18; S2 4.32,4.18 | smd 1 x 1.8: S3 -4.32,0; S4 4.32,0 | smd 1 x 1.8 bottom: S5 -4.32,0; S6 4.32,0 | smd 1 x 2.1 bottom: S7 4.32,4.18; S8 -4.32,4.18 | hole 0.6: -2.89,3.68; 2.89,3.68
62101021021 = smd 0.75 x 2.4: 1 -2.54,-1.95; 2 -2.54,1.95; 3 -1.27,-1.95; 4 -1.27,1.95; 5 0,-1.95; 6 0,1.95; 7 1.27,-1.95; 8 1.27,1.95; 9 2.54,-1.95; 10 2.54,1.95
L0603 = smd 1.1 x 1: 1 -0.85,0; 2 0.85,0
0603 = smd 1.1 x 1: 1 -0.85,0; 2 0.85,0
CHIPLEDX2 = smd 0.6 x 1.2: A1 -0.475,0.9; A2 0.475,0.9; C1 -0.475,-0.9; C2 0.475,-0.9
FOX924B = smd 1.6 x 1.3: 1 -2,-1.25; 2 2,-1.25; 3 2,1.25; 4 -2,1.25
R0805 = smd 1.3 x 1.5: 1 -0.95,0; 2 0.95,0
3.8X2.03 = smd 3.8 x 2.03: TP 0,0
SOT23-6L = smd 0.55 x 1.2: 1 -0.95,-1.3; 2 0,-1.3; 3 0.95,-1.3; 4 0.95,1.3; 5 0,1.3; 6 -0.95,1.3
SOT23-5L = smd 0.55 x 1.2: 1 -0.95,-1.3; 2 0,-1.3; 3 0.95,-1.3; 4 0.95,1.3; 5 -0.95,1.3
SOT-23 = smd 0.55 x 1: 1 -0.95,-1.35; 2 0,-1.35; 3 0.95,-1.35; 4 0.95,1.35; 5 -0.95,1.35
MSOP10 = smd 0.25 x 1: 1 -1,-2.113; 2 -0.5,-2.113; 3 0,-2.113; 4 0.5,-2.113; 5 1,-2.113; 6 1,2.113; 7 0.5,2.113; 8 0,2.113; 9 -0.5,2.113; 10 -1,2.113
VSSOP8 = smd 0.45 x 1.45: 1 -0.975,-2.2; 2 -0.325,-2.2; 3 0.325,-2.2; 4 0.975,-2.2; 5 0.975,2.2; 6 0.325,2.2; 7 -0.325,2.2; 8 -0.975,2.2
A-DF_09 = drill 1 pad 1.676 octagon: 1 -5.6,-1.4; 2 -2.8,-1.4; 3 0,-1.4; 4 2.8,-1.4; 5 5.6,-1.4; 6 -4.2,1.4; 7 -1.4,1.4; 8 1.4,1.4; 9 4.2,1.4 | drill 3.05 pad 5.08: G1 -12.495,0; G2 12.495,0

### Placement (x,y rotation side)
C1  57.5,54 180 top
C2  57.5,58.25 180 top
C3  57.5,62.5 180 top
C4  57.5,66.75 180 top
C5  10.5,15.5 270 top
C6  8,15.5 270 top
C7  11.25,30 0 top
C8  7.25,30 180 top
C9  67,18 180 top
C10  50,18 180 top
C11  36,27.5 180 top
C12  52.75,27.5 180 top
C13  38.75,41.75 0 top
C14  39.25,49.75 0 top
C15  35,42.25 90 top
C16  29,42.75 90 top
C17  14.25,71 180 top
C18  17.5,74.25 0 top
C19  51.25,47 0 top
C20  50.75,39 0 top
C21  23,74.25 180 top
C22  23.5,66 0 top
C23  30.25,75.75 180 top
C24  39.25,68 0 top
C25  27.75,66 270 top
C26  24.62,50.25 0 top
C27  24.62,59 0 top
C28  24.62,61 0 top
C29  24.62,52.25 0 top
C30  16,59.75 270 top
C31  13,60.25 270 top
C32  11,60.25 270 top
C33  17.25,63.75 90 top
C34  16,51 270 top
C35  13,51.5 270 top
C36  11,51.5 270 top
C37  17.25,55 90 top
C38  8.25,32.5 90 top
C39  18.5,41.25 270 top
C40  14.75,42.25 0 top
C41  14.75,44.25 0 top
C42  28,70.25 270 top
C43  42.5,63.75 270 top
C44  44.5,72.75 90 top
C45  34.75,54.5 0 top
C46  33.75,63.5 0 top
C47  27.25,6 0 top
C48  22,12 0 top
C49  30.91,28.5 90 top
C50  32.75,19.5 90 top
C51  39.5,61.5 180 top
C52  30.25,60.25 90 top
C53  32,68.75 180 top
C54  33,59.75 180 top
C55  26.25,73.75 180 top
F1  22,14 180 top
F2  36.75,30.5 90 top
F3  36,49.75 0 top
F4  51.25,49 180 top
F5  27,42.75 270 top
F6  53.5,30.5 90 top
H1  3,87 0 top
H2  67,3 0 top
H3  67,87 0 top
H4  3,3 0 top
IC1  12.5,23 0 top
IC2  42,21.75 90 top
IC3  59,21.75 90 top
IC4  13.75,73.5 270 top
IC5  23,70 180 top
IC6  29.5,73.25 270 top
IC7  39.75,71.5 90 top
IC9  46,63.25 0 top
IC10  14.25,36.25 180 top
IC11  ISO1541  [SOIC8']  29,23 270 top
IC12  27.25,9.75 0 top
IC13  31.25,56.75 0 top
IC14  41,58.75 0 top
IC15  30.25,65.75 0 top
J1  15,2 0 top
J2  22,28 0 top
L1  50,20.5 0 top
L2  67,20.5 0 top
L3  12,48.75 180 top
LED3  4,34.62 90 top
Q1  11,44.25 270 top
R1  12,66 0 top
R2  34.5,37.75 90 top
R3  37.75,57 90 top
R4  35.75,57 90 top
R5  53.5,68.75 180 top
R6  57.5,64.5 180 top
R7  53.5,64.5 180 top
R8  57.5,68.75 180 top
R9  16,15.5 90 top
R10  14,15.5 90 top
R11  17.75,11.5 270 top
R12  12.25,11.5 270 top
R13  21,2.75 270 top
R14  39.25,47.75 180 top
R15  41.75,48.75 270 top
R16  51.25,45 180 top
R17  53.75,46 270 top
R18  19.75,62.75 180 top
R19  19.75,64.75 180 top
R20  19.75,54 180 top
R21  19.75,56 180 top
R22  20.75,39.25 270 top
R23  26,70.25 270 top
R24  33.75,70.75 0 top
R25  34.75,66 90 top
R26  57.5,60.25 180 top
R27  53.5,60.25 180 top
R28  57.5,56 180 top
R29  53.5,56 180 top
R30  30.25,16.75 270 top
R31  28.25,16.75 270 top
R32  26,14 0 top
R33  32,38.25 0 top
R34  31.25,36.25 0 top
R35  17.75,80 0 top
R36  34.75,30.5 90 top
R37  51.5,30.5 90 top
R38  26.25,75.75 180 top
R39  19.75,70.25 0 top
R40  19.75,72.25 0 top
R41  4,31.25 180 top
R42  52.5,80 180 top
R43  23.75,39.25 270 top
R44  12,57.25 0 top
R45  4,29.25 0 top
R46  32.75,66 90 top
R47  33.75,57 90 top
TP1  66,9 0 top
TP2  66,35 0 top
U1  15,11 0 top
U2  51.25,42 0 top
U3  39.25,44.75 0 top
U4  32,42.75 90 top
U5  12,63.5 90 top
U6  12,54.75 90 top
U7  20.12,60 90 top
U8  20.12,51.25 90 top
X2  35,80 0 top

### Tracks (layer width: path | path; a pad name or v marks a point on that pad's centre or on a via)
!MUX_EN  (via drill 0.3)
  Top 0.254: IC9.6 46.95,59.45 44.75,57.25 44.75,38.5 42,35.75 v38.25,35.75 | IC10.28 29.15,35.85 v29.25,35.75 | R2.1 v34.5,35.75
  Bottom 0.254: v38.25,35.75 v34.5,35.75 v29.25,35.75
!NRST
  Top 0.254: IC10.4 14.65,34.85 16,33.5 17,33.5 18.25,32.25 24,32.25 24.54,31.71 J2.10
!OUTPUT_ENABLE  (via drill 0.3)
  Top 0.254: IC10.18 12.25,33.25 v11.75,33.75 | R45.1 2.25,29.25 1.25,30.25 v1.25,36.5 1.25,79.25 6,84 26,84 30.75,79.25 30.75,78 31.5,77.25 32.5,77.25 33.5,76.25 33.5,74 32.75,73.25 IC6.5
  Bottom 0.254: v11.75,33.75 4,33.75 v1.25,36.5
+3V3  (via drill 0.35)
  Top 0.254: R2.2 34.15,38.25 R33.2 | U5.10 10.75,62.5 11,62.25 | 11,62.25 C32.1 | U6.10 10.75,53.75 11,53.5 | 11,53.5 C36.1 | R1.2 11.8,64.95 11.8,63.05 11,62.25 | R44.2 11.75,56.15 11.75,54.25 11,53.5
  Top 0.305: IC1.12 IC1.13 IC1.14 | R34.2 33,36.25 | R45.2 R41.1
  Top 0.406: IC1.16 8.05,29.95 8.25,30.15 C38.1 8.6,32 IC10.17 | IC10.5 13.85,42.2 C40.1 14.25,42.6 14.25,43.9 C41.1 13.9,45.5 15.15,46.75 | 19.75,46.75 15.15,46.75 | 15.15,46.75 12.25,46.75 Q1.4 11.15,47.35 L3.2 10.25,48.75 9,50 v9,52 10.65,52 C36.1 | IC11.1 C49.1 31.25,28 v32,28 32.25,28 33,28.75 33,36.25 33,38.1 | J2.1 v19.46,28 | IC10.1 17.05,41.3 17.6,41.85 18.25,41.85 C39.1 18.5,45.5 19.75,46.75 | 25.85,43.6 25.5,43.25 25.5,41 26.25,40.25 31.75,40.25 33,39 33,38.1 | F5.1 25.85,43.6 | 25.85,43.6 25.5,43.95 25.5,45.5 24.25,46.75 19.75,46.75 | 33,38.1 R33.2 | v9,57.5 9,60.25 9.6,60.85 10.75,60.85 C32.1 | v5,28 5,29.1 R45.2
  Top 0.508: IC1.14 10.6,29.8 C7.1 v9.25,30 C8.1 8.05,29.95
  Bottom 0.406: v32,28 v19.46,28 11.25,28 | v9.25,30 11.25,28 | v9,52 v9,57.5 | 11.25,28 v5,28
  pour Top (no thermals): 27.5,43.25 27.5,44 25.25,44 25.25,43 27.5,43
+3V3A  (via drill 0.35)
  Top 0.254: U5.2 13.25,63 13,62.75 C31.1 | U6.2 13.25,54.25 13,54 C35.1
  Top 0.406: C31.1 13.15,61.1 13.25,61 v14.25,61 | C35.1 13.05,52.35 13.15,52.25 v14.25,52.25 | v14.25,48.75 L3.1
  Bottom 0.406: 12,52.25 v14.25,52.25 | v14.25,61 12.75,61 12,60.25 12,52.25 | v14.25,48.75 13,48.75 12,49.75 12,52.25
+4V5  (via drill 0.3, 0.35, 0.45)
  Top 0.305: U7.3 U7.2 U7.1 | U8.1 U8.2 U8.3 | IC4.3 12.25,72.35 v12.25,71.75
  Top 0.406: IC5.7 23.32,66.67 C22.1 22.75,65.9 v22.75,65 | IC15.6 29.15,66.75 27.85,66.75 C25.1 27.65,66.75 v26,66.75 | IC13.6 30.3,59.35 C52.1 30,59.65 29.25,59.65 28.5,58.9 v28.5,55.25 | U7.1 23.75,59.02 C27.1 24,58.77 v24,58 | U8.1 23.75,50.27 23.88,50.15 23.88,49.38 24.5,48.75 33,48.75 v34,49.75
  Top 0.508: F3.1 v34,49.75 | v15,69.75 15,70.9 C17.1
  Top 0.813: 23.88,50.15 C26.1
  Bottom 0.305: v12.25,71.75 13,71.75 v15,69.75
  Bottom 0.406: v26,66.75 22.75,66.75
  Bottom 0.508: v34,49.75 v28.5,55.25 26.75,55.25 v24,58 24,63.75 v22.75,65 22.75,66.75 19.75,69.75 v15,69.75
  pour Top (no thermals): 14.5,72.75 14.5,69.25 15.5,69.25 15.5,72.75
+5V
  Top 0.254: U4.3 33.35,44.85 33.75,45.25 36.25,45.25 36.75,44.75 36.75,41.75
  Top 0.406: F2.2 34.85,31.35 R36.2
  Top 0.508: 35.17,41.58 35.35,41.75 36.75,41.75 | U4.1 34.95,41.8 35.17,41.58 | U3.1 38.3,42.15 C13.1 | C15.1 35.17,41.58
  Top 0.61: 36.75,41.75 F2.2
  pour Top (no thermals): 38.5,44 38.5,41.5 32.75,41.5 32.75,42 38,42 38,44
+10V  (via drill 0.4, 0.45, 0.5)
  Top 0.406: IC9.16 43.78,64.78 43.25,64.25 42.85,64.25 C43.1 42.15,64.25 41,64.25 40.1,65.15 | 40.1,65.15 40.1,61.75 C51.1 40.05,61.2 IC14.6 | 40.1,65.15 v38.5,66.75
  Top 0.508: IC7.8 38.16,69.59 38.5,69.25 38.5,68.1 C24.1 38.5,67.9 v38.5,66.75 | v32.5,75.25 32,75.75 C23.1 30.65,75.3 IC6.6 | F4.1 52.1,50.15 v47.5,54.75
  Bottom 0.508: v32.5,75.25 32.5,72.75 v38.5,66.75 38.5,63.75 v47.5,54.75
ADC_CONVST  (via drill 0.3)
  Top 0.254: U6.6 8.5,55.75 v7.75,56.5 v7.75,61.5 | U5.6 8.25,64.5 v8,64.75 | IC10.8 8.75,40.5 7.75,41.5 v7.75,52.75
  Bottom 0.254: v7.75,61.5 7.75,64.5 v8,64.75 | v7.75,52.75 v7.75,56.5
ADC_CS1  (via drill 0.3)
  Top 0.254: IC10.9 9.2,39.05 7,41.25 v7,52.25 | v7,56 7,62.25 7.75,63 9.75,63 U5.9 10.75,63 11.15,63.4 R1.1
  Bottom 0.254: v7,52.25 v7,56
ADC_CS2
  Top 0.254: IC10.10 9,38.25 6.25,41 6.25,52.5 8,54.25 U6.9 10.75,54.25 11.15,54.65 R44.1
ADC_CURRENT
  Top 0.406: R20.1 29.5,54 30.3,54.8 IC13.1 30.3,56.3 30.75,56.75 31.75,56.75 32.2,57.2 IC13.4 32.2,59.7 C54.2
ADC_MISO  (via drill 0.3)
  Top 0.254: IC10.12 8.6,36.65 4.75,40.5 v4.75,53 4.75,62.75 6,64 U5.7 | U6.7 7,55.25 v6.25,54.5
  Bottom 0.254: v6.25,54.5 v4.75,53
ADC_SCK
  Top 0.254: 5.5,52.75 7.5,54.75 U6.8 | 5.5,52.75 5.5,40.75 8.8,37.45 IC10.11 | 5.5,52.75 5.5,62.5 6.5,63.5 U5.8
ADC_VOLTAGE
  Top 0.406: C53.2 31.2,68.7 IC15.4 31.2,66.2 30.75,65.75 29.75,65.75 29.3,65.3 IC15.1 29.3,63.8 28.25,62.75 R18.1
CE
  Top 0.406: R38.2 25.4,77.4 26.6,78.6 X2.1
CLOCK
  Top 0.305: IC10.6 13.05,41.45 Q1.3
DAC_AUX
  Top 0.254: IC5.5 22.02,68.47 21.75,68.75 18,68.75 16.62,67.38 7.62,67.38 3.5,63.25 3.5,40.25 7.9,35.85 IC10.13
GND  (via drill 0.3, 0.35, 0.4, 0.45, 0.5, 0.6)
  Top 0.2: C34.2 16,48.67 arc90 16.18,48.5 arc90 16.35,48.67 16.35,48.95 arc-90 16.52,49.12 arc-90 16.7,48.95 16.7,48.67 arc90 16.88,48.5 arc90 17.05,48.67 17.05,48.95 arc-90 17.23,49.12 arc-90 17.4,48.95 17.4,48.88 arc90 17.52,48.75 v18.25,48.75 | C30.2 16,57.42 arc90 16.18,57.25 arc90 16.35,57.42 16.35,57.7 arc-90 16.52,57.88 arc-90 16.7,57.7 16.7,57.42 arc90 16.88,57.25 arc90 17.05,57.42 17.05,57.7 arc-90 17.23,57.88 arc-90 17.4,57.7 17.4,57.62 arc90 17.52,57.5 v18.25,57.5
  Top 0.254: R22.1 20.1,40.75 v19.5,40.75 | IC5.2 23.32,72.92 22.15,74.1 C21.2
  Top 0.305: U5.5 v13,64.5 | U6.5 v13,55.75
  Top 0.406: IC10.16 8.35,33.45 C38.2 7.9,33 v7.25,33 | C8.2 6.75,29.65 v6.75,29 | IC1.15 v9.32,26 | C7.2 v13.25,30 | IC1.9 v16.95,26 | Q1.2 v9.75,43.75 | C39.2 18.85,40.75 v19.5,40.75 | C40.2 15.25,42.6 15.25,43.9 C41.2 15.25,44.6 v15.25,45.25 | IC11.4 v27.09,27 26.25,27 25.25,28 22.5,28 22,27.5 J2.5 J2.3 | C49.2 31.25,29 v32,29 | IC5.8 23.98,66.38 C22.2 24.27,65.92 v24.27,65.02 | R19.1 20.5,64.85 v20.5,66 | R21.1 20.57,56.03 v20.57,57.2 | C43.2 42.2,63.2 v41.45,63.2 | C24.2 40,67.9 | C42.2 v28,68.25 | C51.2 38.75,61.4 v38.75,60.25 | IC15.2 v30.25,63 C52.2 | C46.2 v35.75,63.5 35.75,64.75 35.35,65.15 R25.1 | C25.2 27.65,65.25 v26.75,65.25 | v36.75,54.5 C45.2 35.6,56 R4.1 | R37.1 51.9,29.15 C12.2 | R36.1 35.15,29.15 C11.2
  Top 0.508: IC10.32 C39.2 | 40,67.9 v40,66.75 | C23.2 29.5,75.65 v29.5,74.5 29.5,73.5 29.25,73.25 IC6.2 | IC7.4 44.3,73.41 C44.2 v44.5,74.75
  Top 0.61: IC2.4 v49,25.56 | IC3.4 v66,25.56 | C11.2 v33.75,27.5 | C12.2 v50.5,27.5 | C16.2 v29,45
  Top 0.813: R42.1 v54.75,80
  other vias: 35,44.25 13.5,69.75 20.25,74.25 14.25,50.62 14.25,59.38 39.5,40.5 26.62,50.25 26.62,59 48,59.25 53.75,48 51.5,37.75 41.75,50.75
  pour Top (no thermals): 39,44 39,40 40,40 40,42.25 39.5,42.25 39.5,44
  pour Bottom: 0,24 0,87 arc-90 3,90 67,90 arc-90 70,87 70,24
  pour Top (no thermals): 32.75,42.5 35.5,42.5 35.5,44.75 34.5,44.75 34.5,43 32.75,43
  pour Top (no thermals): 13,71.75 13,69.25 14,69.25 14,73.75 11.75,73.75 11.75,73.25 13.5,73.25 13.5,71.75
  pour Top (no thermals): 17.75,74.75 22.75,74.75 22.75,73.75 17.75,73.75
  pour Top (no thermals): 14.88,51.25 10.5,51.25 10.5,50 14.88,50
  pour Top (no thermals): 14.88,60 10.5,60 10.5,58.75 14.88,58.75
  pour Top (no thermals): 39.5,49.25 39.5,50.25 41.25,50.25 41.25,51.25 42.25,51.25 42.25,49.25
  pour Top (no thermals): 24.88,52.75 24.88,49.75 27.12,49.75 27.12,50.75 26.12,50.75 26.12,52.75
  pour Top (no thermals): 24.88,61.6 24.88,58.5 27,58.5 27,59.5 26.12,59.5 26.12,61.6
  pour Top (no thermals): 47.5,61.25 48.5,61.25 48.5,58.75 47.5,58.75
  pour Top (no thermals): 51.5,46.5 51.5,47.5 53.25,47.5 53.25,48.5 54.25,48.5 54.25,46.5
  cutout Top: 8.44,44 8.44,47.75 28.81,47.75 32.06,44.5 32.06,42.75 31.94,42.75 31.94,44.44 28.75,47.62 8.56,47.62 8.56,44
  cutout Bottom: 8.44,44 8.44,47.75 28.81,47.75 32.06,44.5 32.06,42.75 31.94,42.75 31.94,44.44 28.75,47.62 8.56,47.62 8.56,44
  pour Top (no thermals): 51,41.25 51,37.25 52,37.25 52,39.5 51.5,39.5 51.5,41.25
  pour Top (no thermals): 17.25,51.12 17.25,50 17.75,50 17.75,48.38 18.62,48.38 18.62,51.12
  cutout Top: 15.25,50.75 15.25,48.38 17.5,48.38 17.5,49.75 16.75,49.75 16.75,50.75
  pour Top (no thermals): 17.25,59.88 17.25,58.75 17.75,58.75 17.75,57.12 18.62,57.12 18.62,59.88
  cutout Top: 15.25,59.5 15.25,57.12 17.5,57.12 17.5,58.5 16.75,58.5 16.75,59.5
  pour Top (rank 2): 0,24 70,24 70,87 arc90 67,90 3,90 arc90 0,87
GNDIO  (via drill 0.35, 0.45, 0.6)
  Top 0.305: IC12.3 IC12.4 IC12.5 IC12.6
  Top 0.406: IC12.6 28.88,6.78 C47.2 28,5.9 v28,5 | v33.75,20 33.1,20 C50.2 32.75,21.25 32.25,21.75 27.5,21.75 27.09,21.34 IC11.5
  Top 0.508: v6.75,14.75 7.9,14.75 C6.2 8.1,14.75 9.25,14.75 | C5.2 10.4,14.75 9.25,14.75 | 9.25,14.75 9.32,14.82 IC1.2 9.32,19.82 9.75,20.25 16.5,20.25 16.95,19.8 IC1.8
  Top 0.61: R13.1 21,4.1 22.75,5.85 v22.75,10.75 | IC2.1 47.14,18 C10.2 49.25,17.9 v49.25,16.75 | IC3.1 64.14,18 C9.2 66.25,17.9 v66.25,16.75
  Top 0.813: C48.2 22.75,11.9 v22.75,10.75
  other vias: 15,8.5 18.7,8 11.3,8 15.05,4.25
  pour Top (no thermals): 14.75,10.5 15.25,10.5 15.25,8.25 14.75,8.25
  pour Bottom: 0,22 70,22 70,3 arc-90 67,0 3,0 arc-90 0,3
  pour Top (rank 2): 3,0 67,0 arc90 70,3 70,22 0,22 0,3 arc90
  pour Top (no thermals): 10.75,6.25 12.25,6.25 12.25,8.5 10.75,8.5
  pour Top (no thermals): 17.75,6.25 19.25,6.25 19.25,8.5 17.75,8.5
MUX_A0  (via drill 0.3)
  Top 0.254: IC9.10 47.59,66.84 48.25,67.5 49.25,67.5 49.75,67 49.75,58.75 45.75,54.75 45.75,38 42,34.25 v38.25,34.25 | IC10.26 v29.25,34.25
  Bottom 0.254: v38.25,34.25 v29.25,34.25
MUX_A1  (via drill 0.3)
  Top 0.254: IC9.9 48.22,66.72 48.5,67 49,67 49.25,66.75 49.25,59 45.25,55 45.25,38.25 42,35 v37.75,35 | IC10.27 28.7,35.05 v28.75,35
  Bottom 0.254: v37.75,35 v28.75,35
MUX_GAIN1  (via drill 0.3)
  Top 0.305: IC9.12 v46.32,64 | v51.25,68.75 R5.2 | IC9.1 v43.78,63.5
  Top 0.406: R5.2 52.55,67.7 53.5,66.75 C4.2
  Bottom 0.305: v51.25,68.75 51.25,67.25 48,64 v46.32,64 44.28,64 v43.78,63.5
MUX_GAIN2  (via drill 0.3)
  Top 0.305: IC9.14 v45.05,63.25 | v51.25,64.5 R7.2 | IC9.5 46.32,61.57 v48,63.25
  Top 0.406: R7.2 52.55,63.45 53.5,62.5 C3.2
  Bottom 0.305: v45.05,63.25 v48,63.25 50,63.25 v51.25,64.5
MUX_GAIN3  (via drill 0.3)
  Top 0.305: v51.25,60.25 R27.2 | IC9.15 v44.41,62.5 IC9.2
  Top 0.406: R27.2 52.55,59.2 53.5,58.25 C2.2
  Bottom 0.305: v51.25,60.25 49,62.5 v44.41,62.5
MUX_GAIN4  (via drill 0.3)
  Top 0.305: IC9.4 v45.68,61.75 46.95,63.02 IC9.11 | v51.25,56 R29.2
  Top 0.406: R29.2 52.55,54.95 53.5,54 C1.2
  Bottom 0.305: v51.25,56 51.25,57.5 47,61.75 v45.68,61.75
MUX_IN
  Top 0.406: IC7.1 44.91,69.59 45.68,68.82 IC9.13
MUX_OUT
  Top 0.406: IC9.3 45.05,58.8 43.7,57.45 42.1,57.45 IC14.3
N$1
  Top 0.406: IC5.6 22.68,68.92 23.15,69.4 R23.2
N$2  (via drill 0.3)
  Top 0.2: 38.5,71.8 38.2,71.5 37.05,71.5 36.1,71.5 35.8,71.8 35.8,72.3 34.4,73.7 34.4,77.3 33.65,78.05 33.65,79.2 34.45,80 35.55,80 36.35,79.2 36.35,78 35.6,77.25 35.6,74.3 35.9,74 38.2,74 38.5,73.7 v38.5,72.75 38.5,71.8
  Top 0.406: R24.2 34.72,70.86 IC7.7 37.05,71.5 IC7.6
  Bottom 0.2: v38.5,72.75 38.5,73.7 38.2,74 35.9,74 35.6,74.3 35.6,77.25 36.35,78 36.35,79.2 35.55,80 34.45,80 33.65,79.2 33.65,78.05 34.4,77.3 34.4,73.7 35.8,72.3 35.8,71.8 36.1,71.5 38.2,71.5 38.5,71.8 v38.5,72.75
N$3  (via drill 0.3)
  Top 0.305: v27,72.3 25.85,72.3 25.4,72.75 C55.2 | v29.5,72.3 IC6.4
  Top 0.406: IC6.4 30.65,71.6 31.5,70.75 R24.1 32.9,68.8 C53.1 32.75,68.65 R46.2 R25.2
  Bottom 0.305: v27,72.3 v29.5,72.3
N$4
  Top 0.406: U7.4 22.35,61 C28.1
N$5
  Top 0.406: IC13.3 32.2,54.8 32.5,54.5 C45.1 34,54.6 34,55.9 R47.1
N$6
  Top 0.305: IC1.5 IC1.4 IC1.3
  Top 0.508: IC1.3 10.6,16.45 C5.1
N$7
  Top 0.305: U1.6 14.05,14.6 R10.1
N$8
  Top 0.305: U1.4 15.95,14.6 R9.1
N$9
  Top 0.305: IC1.7 15.68,16.68 R9.2
N$10
  Top 0.254: IC12.12 25.62,13.43 R32.1
  Top 0.406: IC12.1 IC12.2 26.27,6.12 C47.1 25,6 24,7 24,14
  Top 0.61: F1.1 24,14 R32.1
N$11
  Top 0.305: U1.1 14.05,7.95 14.25,7.75 J1.B7 14.25,6 14.5,5.75 15,5.75 15.25,6 J1.A7
N$12
  Top 0.305: 15.75,7.75 J1.B6 | U1.3 15.95,7.95 15.75,7.75 | J1.A6 14.75,7.5 15,7.75 15.75,7.75
N$13
  Top 0.254: J1.A5 13.75,7.5 13.33,7.92 13.33,9.57 R12.2
N$14
  Top 0.254: J1.B5 16.75,8.25 16.67,8.33 16.67,9.57 R11.2
N$15
  Top 0.305: U3.4 40.2,47.65 | 40.2,47.65 R14.1 | R15.2 40.45,47.9 40.2,47.65
N$16
  Top 0.813: J1.S8 J1.S5 | J1.S7 J1.S6
  Top 1.016: R13.2 19.32,1.9 J1.S6
  pour Top (no thermals): 10.5,2.75 10.5,1.25 19.5,1.25 19.5,2.75
N$17
  Top 0.305: U5.1 15.5,62.5 16,62 C30.1
  Top 0.406: U7.6 16.38,60.33 C30.1 16.27,60.98 U7.5
N$18
  Top 0.254: U5.3 16.65,63.5 C33.1 18.75,62.9 R18.2
N$19
  Top 0.406: F6.2 51.6,31.35 R37.2
  Top 0.61: F6.2 53.5,32.5 49.9,36.1 C20.1
  pour Top (no thermals): 50.5,41.25 50.5,38.5 50,38.5 50,41.25
N$20
  Top 0.305: U2.4 52.2,44.9 R16.1 52.25,45.15 R17.2
N$21
  Top 0.406: U8.4 22.35,52.25 C29.1
N$22
  Top 0.305: U6.1 15.5,53.75 16,53.25 C34.1
  Top 0.406: U8.5 16.27,52.23 C34.1 16.38,51.58 U8.6
N$23
  Top 0.254: U5.4 16.65,64 C33.2 18.75,64.6 R19.2
N$24
  Top 0.254: U6.3 16.65,54.75 C37.1 18.75,54.15 R20.2
N$25
  Top 0.254: U6.4 16.65,55.25 C37.2 18.75,55.85 R21.2
N$26
  Top 0.254: IC10.31 20.6,38.25 R22.2
N$27
  Top 0.406: R23.1 26.1,71 27.9,71 C42.1 28,72.1 28.2,72.3 IC6.3
N$28
  Top 0.406: R5.1 R8.2
N$29
  Top 0.406: R7.1 R6.2
N$30
  Top 0.406: R27.1 R26.2
N$31
  Top 0.406: R29.1 R28.2
N$32
  Top 0.305: IC14.1 40.05,58.3 40.5,58.75 41.5,58.75 41.95,59.2 IC14.4
  Top 0.406: R3.1 39.4,56.15 40.05,56.8 IC14.1
N$33
  Top 0.305: C55.1 R38.1
  Top 0.406: IC6.1 28.35,75.15 27.75,75.75 R38.1
N$34
  Top 0.254: IC5.3 22.68,70.92 22,70.25 R39.2
N$35
  pour Top (no thermals): 54,25.25 54,29.75 53,29.75 53,25.25
N$36
  Top 0.508: U4.5 29.1,41.8 C16.1
  Top 0.61: C16.1 F5.2
N$37
  Top 0.508: U3.5 38.3,47.65 R14.2 38.5,47.85 38.5,49.65 C14.1 F3.2
N$38
  pour Top (no thermals): 50.75,49.5 50.75,42.75 50,42.75 50,49.5
N$39
  Top 0.61: 47.1,20.5 L1.1
  Top 0.813: IC2.2 47.1,20.5
N$40
  Top 1.016: R42.2 X2.G2 46.09,81.4 X2.9 38,81.4 | X2.6 32,81.4 | 32,81.4 X2.7 X2.8 38,81.4 | X2.2 32.2,81.2 32,81.4 | X2.4 37.8,81.2 38,81.4
N$41
  Top 0.61: 64.1,20.5 L2.1
  Top 0.813: IC3.2 64.1,20.5
N$42
  Top 1.016: R35.2 X2.G1
N$43
  Top 0.305: R41.2 3.1,31.3 LED3.A1 LED3.A2
N$44
  pour Top (no thermals): 37.25,30.25 37.25,25.25 36.25,25.25 36.25,30.25
N$45
  Top 0.254: 21.93,72.25 R40.2
  Top 0.305: IC5.4 21.93,72.25
N$46
  Top 0.305: IC1.6 14.4,16.75 R10.2
N$47
  Top 0.406: R46.1 33,64.9 33,63.6 C46.1 31.5,63.5 31.2,63.8 IC15.3
N$48
  Top 0.406: R3.2 R4.2 R47.2 33.75,59.65 C54.1
PWR_ENABLE  (via drill 0.3)
  Top 0.254: U3.3 40.3,43.35 40.65,43.35 41,43 41,41.25 | v16.25,39.25 IC10.2 | v38,38.25 39.75,38.25 41,39.5 41,41.25 | U2.3 52.2,41.55 51.75,42 v47,42 | v22.25,38.25 23.6,38.25 R43.2 23.9,38.25 v29.25,38.25 | 41,41.25 41.75,42 v43.5,42
  Bottom 0.254: v16.25,39.25 17.25,38.25 v22.25,38.25 | v38,38.25 v29.25,38.25 | v47,42 v43.5,42
RE
  Top 0.406: IC7.5 35.59,73.41 35,74 X2.3
SCL  (via drill 0.3)
  Top 0.254: R39.1 18,70.25 17,69.25 17,68.5 16.38,67.88 7.38,67.88 3,63.5 3,39.25 v3.25,39 | R34.1 29.75,36.25 29.35,36.65 IC10.29 17.1,36.65 v17,36.75
  Top 0.305: R34.1 30.5,36.15 30.5,32.25 29,30.75 29,27.5 28.36,26.86 IC11.3
  Bottom 0.254: v3.25,39 5.5,36.75 v17,36.75
SCL_ISO  (via drill 0.3)
  Top 0.305: IC11.6 28.36,18.86 v28.25,18.75 R31.1 | IC12.7 28.88,12.62 v28.5,13
  Bottom 0.305: v28.5,13 28.25,13.25 v28.25,18.75
SDA  (via drill 0.3)
  Top 0.254: R40.1 17.75,72.25 16.5,71 16.5,68.75 16.12,68.38 7.12,68.38 2.5,63.75 v2.5,37.5 | R33.1 30.5,38.25 29.7,37.45 IC10.30 16.7,37.45 16.25,37 v16.25,35.25
  Top 0.305: R33.1 31.25,38.15 31.25,32 29.64,30.39 IC11.2
  Bottom 0.254: v2.5,37.5 4.75,35.25 v16.25,35.25
SDA_ISO  (via drill 0.3)
  Top 0.305: IC12.9 IC12.8 28.25,11.76 28.25,11 28.5,10.75 29.75,10.75 30.25,11.25 v30.25,12.75 | IC11.7 29.64,19.36 v30.25,18.75 R30.1
  Bottom 0.305: v30.25,18.75 v30.25,12.75
STATUS_BAD
  Top 0.254: IC10.15 5,34.25 LED3.C1
STATUS_GOOD
  Top 0.254: IC10.14 4.95,35.05 LED3.C2
SWCLK
  Top 0.254: J2.4 20.73,31.52 20.5,31.75 17.3,31.75 IC10.24
SWDIO
  Top 0.254: J2.2 19.46,30.7 19.21,30.95 16.55,30.95 16.25,31.25 IC10.23
USB_DM
  Top 0.305: IC10.21 14.65,30.75 14.4,30.5 IC1.11
USB_DP
  Top 0.305: IC10.22 15.45,30.75 15.68,30.52 IC1.10
VBUS
  Top 0.254: IC12.11 26.27,13.32 R32.2
  Top 0.406: IC11.8 30.91,19.34 31.25,19 32.4,19 C50.1 32.75,15.5 31.25,14 | R30.2 R31.2 27.1,15.9 26.95,16.05
  Top 0.508: IC1.1 8.05,16.41 C6.1 6.4,16.35 5.5,17.25 5.5,20 6.5,21 22,21 26.95,16.05 R32.2
  Top 0.61: L1.2 C10.1 50.85,15.6 49.25,14 | L2.2 C9.1 67.85,15.6 66.25,14 49.25,14 | R32.2 31.25,14 49.25,14
VBUS_IN  (via drill 0.3, 0.5)
  Top 0.305: U1.5 v15,13.5
  Top 0.61: J1.A4/B9 v12.6,9 | J1.B4/A9 v17.4,9 17.65,9.25 20.25,9.25 21.15,10.15 C48.1 F1.2
  Bottom 0.305: 15,12 v15,13.5 | 15,12 14.5,11.5 14.5,9.5 | 15,12 15.5,11.5 15.5,9.5
  Bottom 0.61: v12.6,9 13.1,9.5 14.5,9.5 15.5,9.5 16.9,9.5 v17.4,9
VREF  (via drill 0.35, 0.45)
  Top 0.2: 45.5,72.75 45.75,72.75 47,71.5 59.5,71.5 61,70 61,53.25 60.5,52.75 58,52.75 57.5,53.25 57.5,69.75 57,70.25 40.75,70.25 40,71 40,77.25 39.25,78 39.25,79.25 40,80 41.25,80 42,79.25 42,78 41.25,77.25 41.25,73 41.5,72.75 45.5,72.75 | v45.5,72 45.5,72.75
  Top 0.406: C44.1 44.6,72 | IC5.1 23.98,74.12 C21.1 23.85,75.15 23.5,75.5 v16.75,75.5
  Top 0.508: IC7.3 44.27,72.14 C44.1 | 44.6,72 v45.5,72
  Top 0.61: R35.1 16.75,79.85 v16.75,75.5
  Bottom 0.2: 45.5,72.75 45.75,72.75 47,71.5 59.5,71.5 61,70 61,53.25 60.5,52.75 58,52.75 57.5,53.25 57.5,69.75 57,70.25 40.75,70.25 40,71 40,77.25 39.25,78 39.25,79.25 40,80 41.25,80 42,79.25 42,78 41.25,77.25 41.25,73 41.5,72.75 45.5,72.75
  Bottom 0.508: v16.75,75.5 16.75,83.75 19,86 41.25,86 43.25,84 43.25,74.25 v45.5,72
  pour Top (no thermals): 17.25,76 16.25,76 16.25,74.75 14.5,74.75 14.5,73.75 17.25,73.75
WE
  Top 0.406: X2.5 40.6,71.37 41.1,70.86 IC7.2 59.24,70.86 60.25,69.85 60.25,69.25 | 60.25,69.25 60.25,65 | 60.25,65 60.25,60.75 | 60.25,60.75 60.25,56.5 59.75,56 R28.1 58.35,55.9 C1.1 | R8.1 58.75,68.75 | 58.75,68.75 59.75,68.75 60.25,69.25 | R6.1 58.75,64.5 | 58.75,64.5 59.75,64.5 60.25,65 | 60.25,60.75 59.75,60.25 R26.1 58.35,60.15 C2.1 | C3.1 58.35,64.1 58.75,64.5 | C4.1 58.35,68.35 58.75,68.75

### Text on the board
tStop: 1 | Potentiostat | 2.0 | Marcel Hasler, 2022 | Hochschule / Bonn-Rhein-Sieg